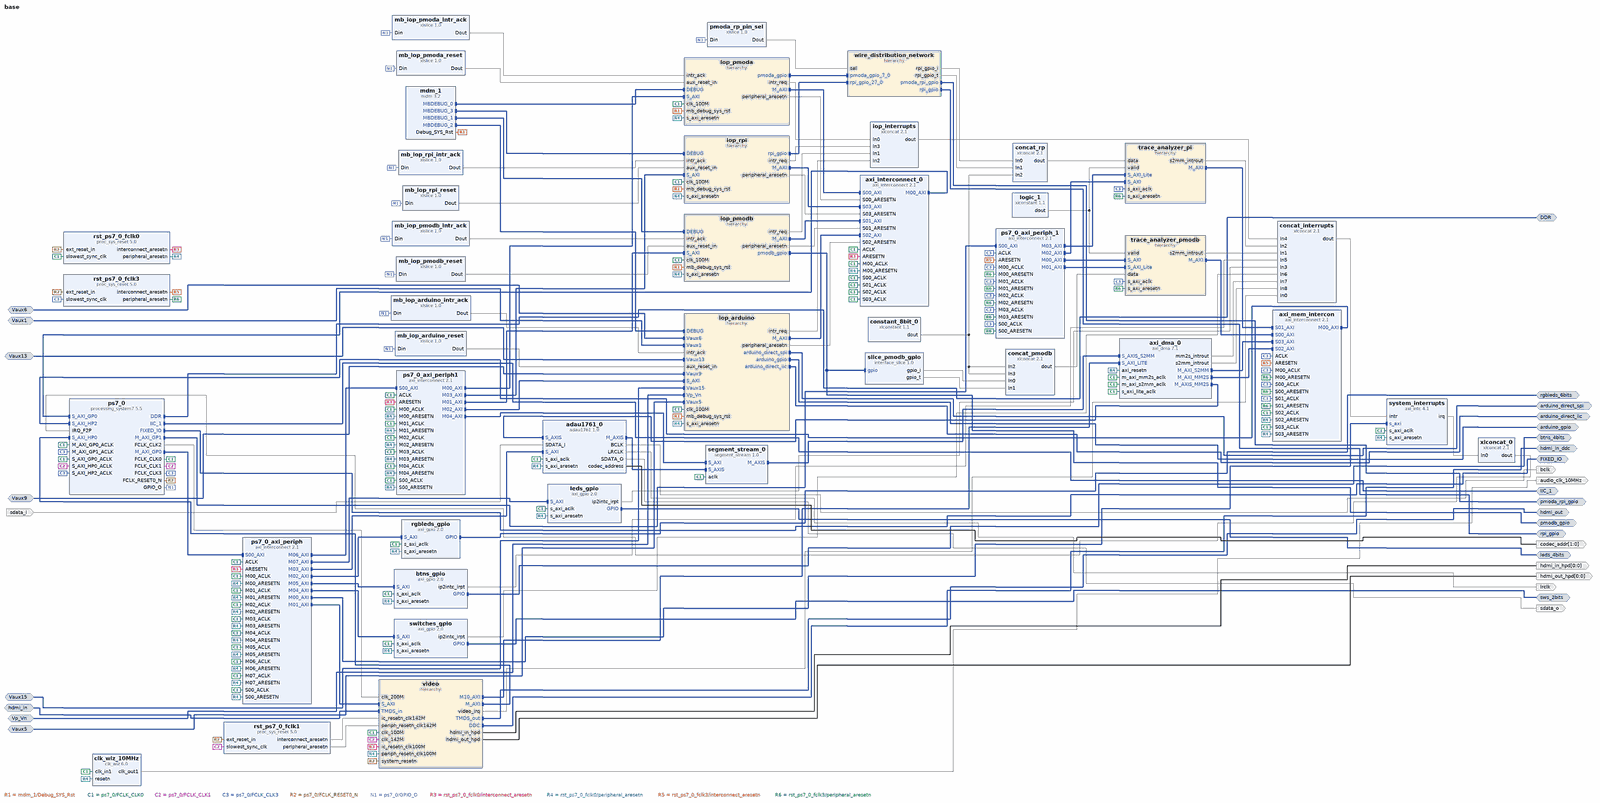
[diagram p0: block diagram of the top level, whole]
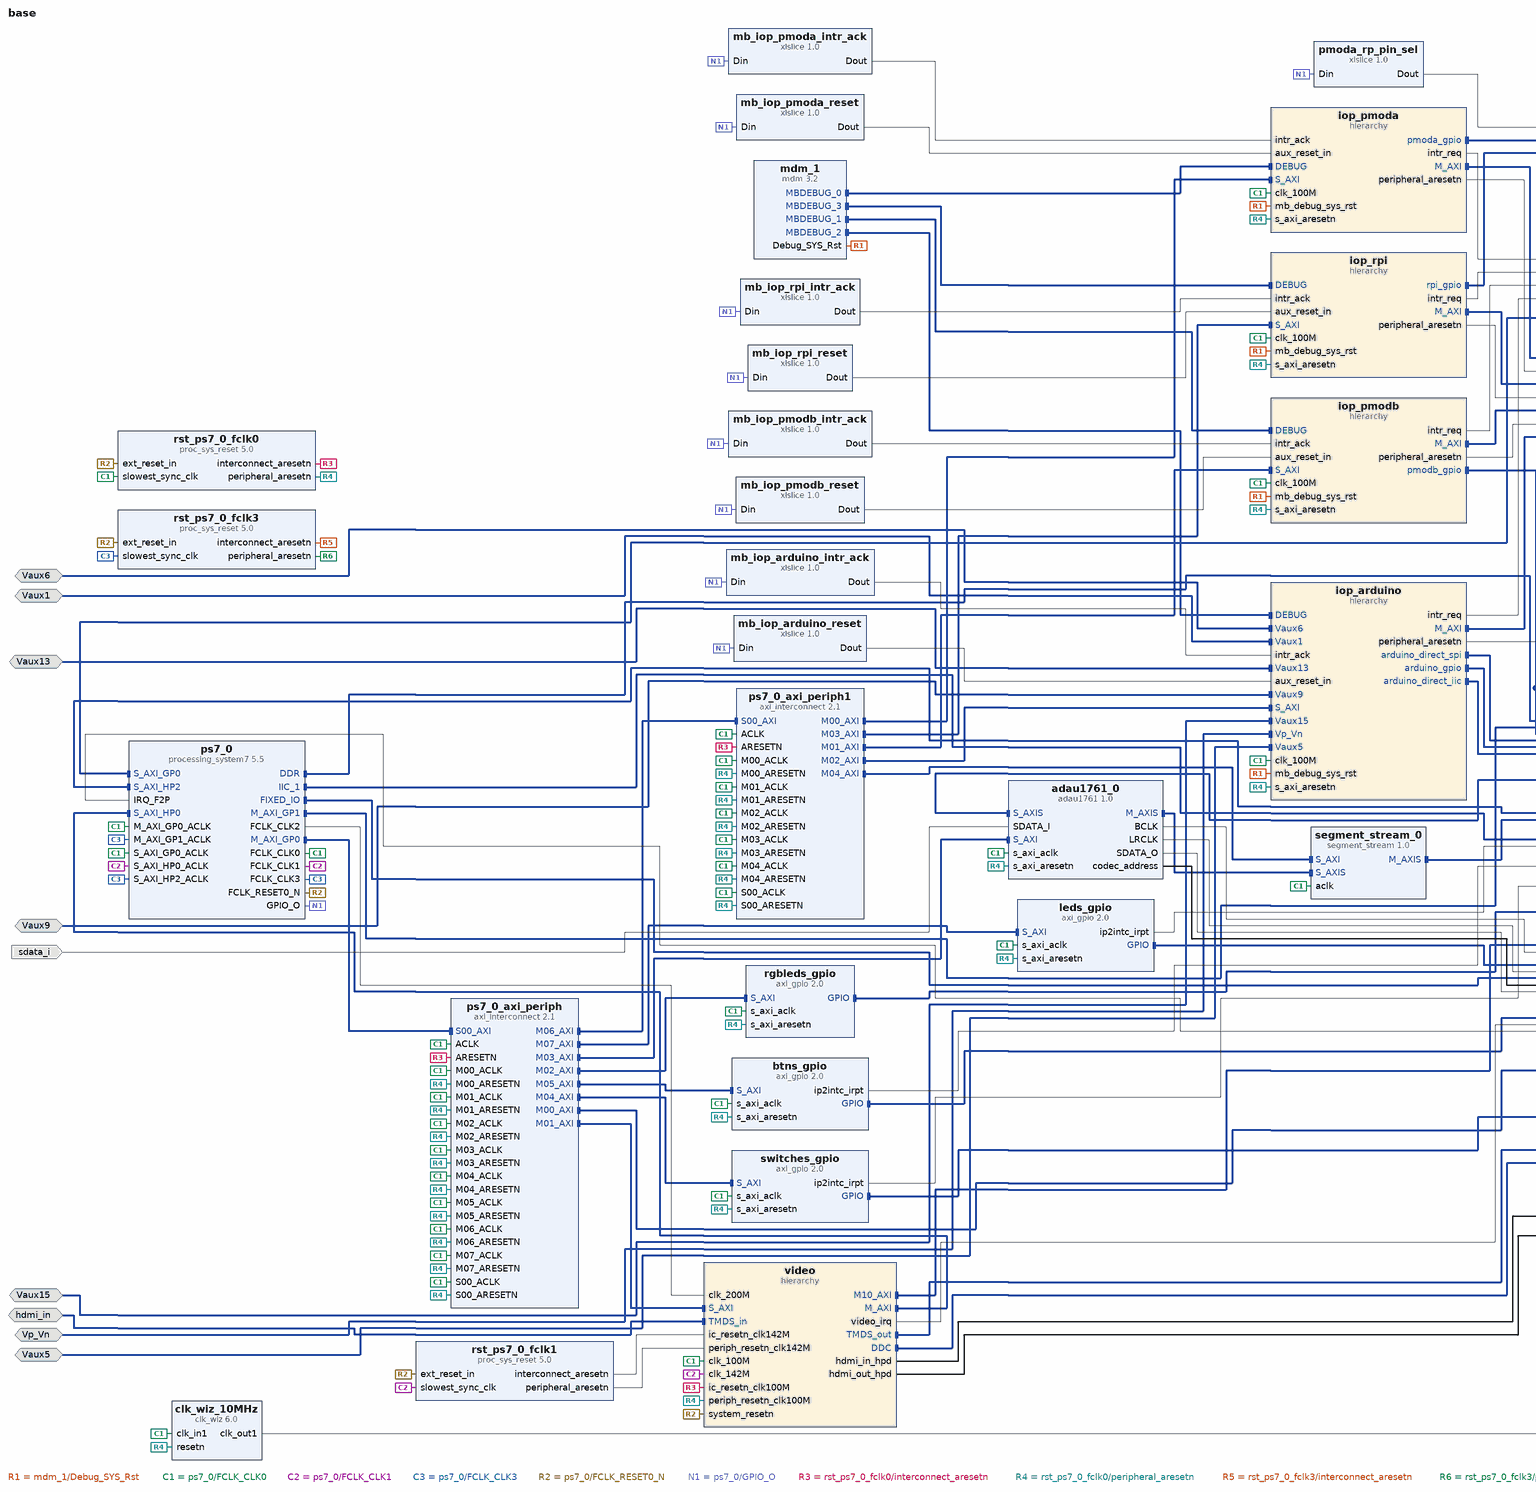
[diagram p1: block diagram of the top level, left part]
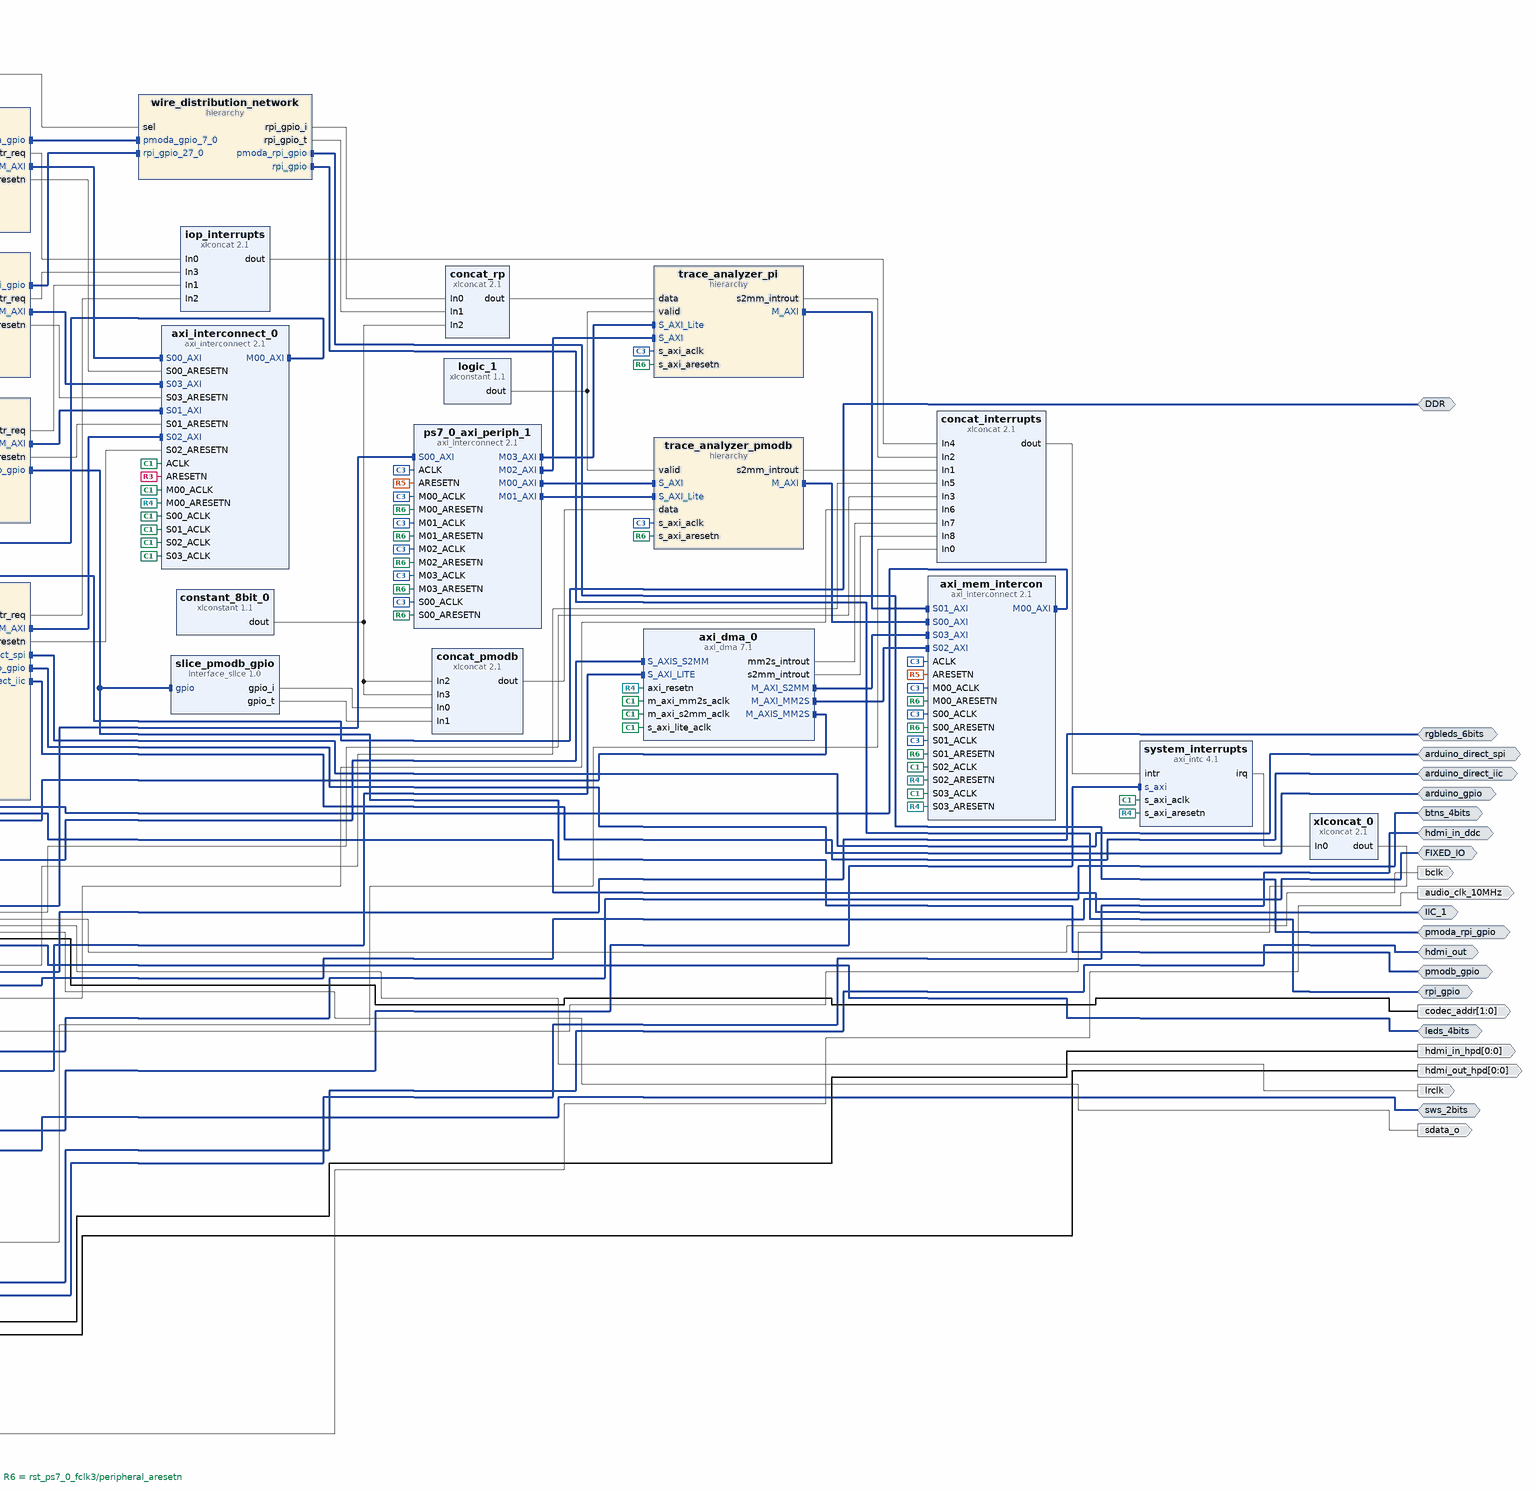
[diagram p2: block diagram of the top level, right part]
# Vivado block design base, xc7z020clg400-1, Vivado 2018.3
create_bd_design base

create_bd_intf_port -mode Master -vlnv xilinx.com:interface:ddrx_rtl:1.0 DDR
create_bd_intf_port -mode Master -vlnv xilinx.com:display_processing_system7:fixedio_rtl:1.0 FIXED_IO
create_bd_intf_port -mode Master -vlnv xilinx.com:interface:iic_rtl:1.0 IIC_1
create_bd_intf_port -mode Slave -vlnv xilinx.com:interface:diff_analog_io_rtl:1.0 Vaux1
create_bd_intf_port -mode Slave -vlnv xilinx.com:interface:diff_analog_io_rtl:1.0 Vaux5
create_bd_intf_port -mode Slave -vlnv xilinx.com:interface:diff_analog_io_rtl:1.0 Vaux6
create_bd_intf_port -mode Slave -vlnv xilinx.com:interface:diff_analog_io_rtl:1.0 Vaux9
create_bd_intf_port -mode Slave -vlnv xilinx.com:interface:diff_analog_io_rtl:1.0 Vaux13
create_bd_intf_port -mode Slave -vlnv xilinx.com:interface:diff_analog_io_rtl:1.0 Vaux15
create_bd_intf_port -mode Slave -vlnv xilinx.com:interface:diff_analog_io_rtl:1.0 Vp_Vn
create_bd_intf_port -mode Master -vlnv xilinx.com:interface:iic_rtl:1.0 arduino_direct_iic
create_bd_intf_port -mode Master -vlnv xilinx.com:interface:spi_rtl:1.0 arduino_direct_spi
create_bd_intf_port -mode Master -vlnv xilinx.com:interface:gpio_rtl:1.0 arduino_gpio
create_bd_intf_port -mode Master -vlnv xilinx.com:interface:gpio_rtl:1.0 btns_4bits
create_bd_intf_port -mode Slave -vlnv digilentinc.com:interface:tmds_rtl:1.0 hdmi_in
create_bd_intf_port -mode Master -vlnv xilinx.com:interface:iic_rtl:1.0 hdmi_in_ddc
create_bd_intf_port -mode Master -vlnv digilentinc.com:interface:tmds_rtl:1.0 hdmi_out
create_bd_intf_port -mode Master -vlnv xilinx.com:interface:gpio_rtl:1.0 leds_4bits
create_bd_intf_port -mode Master -vlnv xilinx.com:interface:gpio_rtl:1.0 pmoda_rpi_gpio
create_bd_intf_port -mode Master -vlnv xilinx.com:interface:gpio_rtl:1.0 pmodb_gpio
create_bd_intf_port -mode Master -vlnv xilinx.com:interface:gpio_rtl:1.0 rgbleds_6bits
create_bd_intf_port -mode Master -vlnv xilinx.com:interface:gpio_rtl:1.0 rpi_gpio
create_bd_intf_port -mode Master -vlnv xilinx.com:interface:gpio_rtl:1.0 sws_2bits
create_bd_port -dir O -type clk audio_clk_10MHz
create_bd_port -dir O bclk
create_bd_port -dir O -from 1 -to 0 codec_addr
create_bd_port -dir O -from 0 -to 0 hdmi_in_hpd
create_bd_port -dir O -from 0 -to 0 hdmi_out_hpd
create_bd_port -dir O lrclk
create_bd_port -dir I sdata_i
create_bd_port -dir O sdata_o

create_bd_cell -type ip -vlnv xilinx.com:ip:axi_interconnect:2.1 axi_interconnect_0
set_property -dict {CONFIG.NUM_MI 1 CONFIG.NUM_SI 4} [get_bd_cells axi_interconnect_0]
create_bd_cell -type ip -vlnv xilinx.com:ip:axi_interconnect:2.1 axi_mem_intercon
set_property -dict {CONFIG.NUM_MI 1 CONFIG.NUM_SI 4} [get_bd_cells axi_mem_intercon]
create_bd_cell -type ip -vlnv xilinx.com:ip:axi_gpio:2.0 btns_gpio
set_property -dict {CONFIG.C_ALL_INPUTS 1 CONFIG.C_GPIO_WIDTH 4 CONFIG.C_INTERRUPT_PRESENT 1} [get_bd_cells btns_gpio]
create_bd_cell -type ip -vlnv xilinx.com:ip:clk_wiz:6.0 clk_wiz_10MHz
set_property -dict [list \
  CONFIG.CLKOUT1_JITTER 290.478 \
  CONFIG.CLKOUT1_PHASE_ERROR 133.882 \
  CONFIG.CLKOUT1_REQUESTED_OUT_FREQ 10.000 \
  CONFIG.MMCM_CLKFBOUT_MULT_F 15.625 \
  CONFIG.MMCM_CLKOUT0_DIVIDE_F 78.125 \
  CONFIG.MMCM_DIVCLK_DIVIDE 2 \
  CONFIG.RESET_PORT resetn \
  CONFIG.RESET_TYPE ACTIVE_LOW \
] [get_bd_cells clk_wiz_10MHz]
create_bd_cell -type ip -vlnv xilinx.com:ip:xlconcat:2.1 concat_interrupts
set_property -dict {CONFIG.NUM_PORTS 9} [get_bd_cells concat_interrupts]
create_bd_cell -type ip -vlnv xilinx.com:ip:xlconcat:2.1 concat_pmodb
set_property -dict {CONFIG.NUM_PORTS 4} [get_bd_cells concat_pmodb]
create_bd_cell -type ip -vlnv xilinx.com:ip:xlconcat:2.1 concat_rp
set_property -dict {CONFIG.NUM_PORTS 3} [get_bd_cells concat_rp]
create_bd_cell -type ip -vlnv xilinx.com:ip:xlconstant:1.1 constant_8bit_0
set_property -dict {CONFIG.CONST_VAL 0 CONFIG.CONST_WIDTH 8} [get_bd_cells constant_8bit_0]
create_bd_cell -type hier iop_arduino
create_bd_cell -type ip -vlnv xilinx.com:ip:xlconcat:2.1 iop_interrupts
set_property -dict {CONFIG.NUM_PORTS 4} [get_bd_cells iop_interrupts]
create_bd_cell -type hier iop_pmoda
create_bd_cell -type hier iop_pmodb
create_bd_cell -type hier iop_rpi
create_bd_cell -type ip -vlnv xilinx.com:ip:axi_gpio:2.0 leds_gpio
set_property -dict [list \
  CONFIG.C_ALL_OUTPUTS 1 \
  CONFIG.C_GPIO_WIDTH 4 \
  CONFIG.C_INTERRUPT_PRESENT 1 \
  CONFIG.C_IS_DUAL 0 \
] [get_bd_cells leds_gpio]
create_bd_cell -type ip -vlnv xilinx.com:ip:xlconstant:1.1 logic_1
create_bd_cell -type ip -vlnv xilinx.com:ip:xlslice:1.0 mb_iop_arduino_intr_ack
set_property -dict [list \
  CONFIG.DIN_FROM 6 \
  CONFIG.DIN_TO 6 \
  CONFIG.DIN_WIDTH 10 \
  CONFIG.DOUT_WIDTH 1 \
] [get_bd_cells mb_iop_arduino_intr_ack]
create_bd_cell -type ip -vlnv xilinx.com:ip:xlslice:1.0 mb_iop_arduino_reset
set_property -dict {CONFIG.DIN_FROM 2 CONFIG.DIN_TO 2 CONFIG.DIN_WIDTH 10 CONFIG.DOUT_WIDTH 1} [get_bd_cells mb_iop_arduino_reset]
create_bd_cell -type ip -vlnv xilinx.com:ip:xlslice:1.0 mb_iop_pmoda_intr_ack
set_property -dict [list \
  CONFIG.DIN_FROM 4 \
  CONFIG.DIN_TO 4 \
  CONFIG.DIN_WIDTH 10 \
  CONFIG.DOUT_WIDTH 1 \
] [get_bd_cells mb_iop_pmoda_intr_ack]
create_bd_cell -type ip -vlnv xilinx.com:ip:xlslice:1.0 mb_iop_pmoda_reset
set_property -dict {CONFIG.DIN_FROM 0 CONFIG.DIN_TO 0 CONFIG.DIN_WIDTH 10 CONFIG.DOUT_WIDTH 1} [get_bd_cells mb_iop_pmoda_reset]
create_bd_cell -type ip -vlnv xilinx.com:ip:xlslice:1.0 mb_iop_pmodb_intr_ack
set_property -dict [list \
  CONFIG.DIN_FROM 5 \
  CONFIG.DIN_TO 5 \
  CONFIG.DIN_WIDTH 10 \
  CONFIG.DOUT_WIDTH 1 \
] [get_bd_cells mb_iop_pmodb_intr_ack]
create_bd_cell -type ip -vlnv xilinx.com:ip:xlslice:1.0 mb_iop_pmodb_reset
set_property -dict {CONFIG.DIN_FROM 1 CONFIG.DIN_TO 1 CONFIG.DIN_WIDTH 10 CONFIG.DOUT_WIDTH 1} [get_bd_cells mb_iop_pmodb_reset]
create_bd_cell -type ip -vlnv xilinx.com:ip:xlslice:1.0 mb_iop_rpi_intr_ack
set_property -dict {CONFIG.DIN_FROM 7 CONFIG.DIN_TO 7 CONFIG.DIN_WIDTH 10 CONFIG.DOUT_WIDTH 1} [get_bd_cells mb_iop_rpi_intr_ack]
create_bd_cell -type ip -vlnv xilinx.com:ip:xlslice:1.0 mb_iop_rpi_reset
set_property -dict {CONFIG.DIN_FROM 3 CONFIG.DIN_TO 3 CONFIG.DIN_WIDTH 10 CONFIG.DOUT_WIDTH 1} [get_bd_cells mb_iop_rpi_reset]
create_bd_cell -type ip -vlnv xilinx.com:ip:mdm:3.2 mdm_1
set_property -dict {CONFIG.C_MB_DBG_PORTS 4} [get_bd_cells mdm_1]
create_bd_cell -type ip -vlnv xilinx.com:ip:xlslice:1.0 pmoda_rp_pin_sel
set_property -dict {CONFIG.DIN_FROM 8 CONFIG.DIN_TO 8 CONFIG.DIN_WIDTH 10 CONFIG.DOUT_WIDTH 1} [get_bd_cells pmoda_rp_pin_sel]
create_bd_cell -type ip -vlnv xilinx.com:ip:processing_system7:5.5 ps7_0
set_property -dict [list \
  CONFIG.PCW_APU_PERIPHERAL_FREQMHZ 650 \
  CONFIG.PCW_CRYSTAL_PERIPHERAL_FREQMHZ 50 \
  CONFIG.PCW_ENET0_ENET0_IO {MIO 16 .. 27} \
  CONFIG.PCW_ENET0_GRP_MDIO_ENABLE 1 \
  CONFIG.PCW_ENET0_GRP_MDIO_IO {MIO 52 .. 53} \
  CONFIG.PCW_ENET0_PERIPHERAL_ENABLE 1 \
  CONFIG.PCW_EN_CLK1_PORT 1 \
  CONFIG.PCW_EN_CLK2_PORT 1 \
  CONFIG.PCW_EN_CLK3_PORT 1 \
  CONFIG.PCW_FCLK_CLK1_BUF TRUE \
  CONFIG.PCW_FCLK_CLK2_BUF TRUE \
  CONFIG.PCW_FCLK_CLK3_BUF TRUE \
  CONFIG.PCW_FPGA0_PERIPHERAL_FREQMHZ 100 \
  CONFIG.PCW_FPGA1_PERIPHERAL_FREQMHZ 142 \
  CONFIG.PCW_FPGA2_PERIPHERAL_FREQMHZ 200 \
  CONFIG.PCW_FPGA3_PERIPHERAL_FREQMHZ 100 \
  CONFIG.PCW_FPGA_FCLK1_ENABLE 1 \
  CONFIG.PCW_FPGA_FCLK2_ENABLE 1 \
  CONFIG.PCW_FPGA_FCLK3_ENABLE 1 \
  CONFIG.PCW_GPIO_EMIO_GPIO_ENABLE 1 \
  CONFIG.PCW_GPIO_EMIO_GPIO_IO 10 \
  CONFIG.PCW_GPIO_EMIO_GPIO_WIDTH 10 \
  CONFIG.PCW_GPIO_MIO_GPIO_ENABLE 0 \
  CONFIG.PCW_I2C0_GRP_INT_ENABLE 1 \
  CONFIG.PCW_I2C0_GRP_INT_IO EMIO \
  CONFIG.PCW_I2C0_I2C0_IO {MIO 50 .. 51} \
  CONFIG.PCW_I2C0_PERIPHERAL_ENABLE 1 \
  CONFIG.PCW_I2C1_I2C1_IO EMIO \
  CONFIG.PCW_I2C1_PERIPHERAL_ENABLE 1 \
  CONFIG.PCW_I2C_PERIPHERAL_FREQMHZ 108.333336 \
  CONFIG.PCW_IRQ_F2P_INTR 1 \
  CONFIG.PCW_PERIPHERAL_BOARD_PRESET None \
  CONFIG.PCW_PRESET_BANK1_VOLTAGE {LVCMOS 1.8V} \
  CONFIG.PCW_QSPI_GRP_FBCLK_ENABLE 1 \
  CONFIG.PCW_QSPI_GRP_FBCLK_IO {MIO 8} \
  CONFIG.PCW_QSPI_GRP_SINGLE_SS_ENABLE 1 \
  CONFIG.PCW_QSPI_GRP_SINGLE_SS_IO {MIO 1 .. 6} \
  CONFIG.PCW_QSPI_PERIPHERAL_ENABLE 1 \
  CONFIG.PCW_QSPI_QSPI_IO {MIO 1 .. 6} \
  CONFIG.PCW_SD0_GRP_CD_ENABLE 1 \
  CONFIG.PCW_SD0_GRP_CD_IO {MIO 47} \
  CONFIG.PCW_SD0_GRP_WP_ENABLE 0 \
  CONFIG.PCW_SD0_PERIPHERAL_ENABLE 1 \
  CONFIG.PCW_SD0_SD0_IO {MIO 40 .. 45} \
  CONFIG.PCW_SDIO_PERIPHERAL_FREQMHZ 50 \
  CONFIG.PCW_SINGLE_QSPI_DATA_MODE x4 \
  CONFIG.PCW_UART0_PERIPHERAL_ENABLE 1 \
  CONFIG.PCW_UART0_UART0_IO {MIO 14 .. 15} \
  CONFIG.PCW_UART1_PERIPHERAL_ENABLE 0 \
  CONFIG.PCW_UART_PERIPHERAL_FREQMHZ 100 \
  CONFIG.PCW_UIPARAM_DDR_BUS_WIDTH {16 Bit} \
  CONFIG.PCW_UIPARAM_DDR_FREQ_MHZ 525 \
  CONFIG.PCW_UIPARAM_DDR_PARTNO Custom \
  CONFIG.PCW_USB0_PERIPHERAL_ENABLE 1 \
  CONFIG.PCW_USB0_USB0_IO {MIO 28 .. 39} \
  CONFIG.PCW_USE_FABRIC_INTERRUPT 1 \
  CONFIG.PCW_USE_M_AXI_GP1 1 \
  CONFIG.PCW_USE_S_AXI_GP0 1 \
  CONFIG.PCW_USE_S_AXI_HP0 1 \
  CONFIG.PCW_USE_S_AXI_HP2 1 \
] [get_bd_cells ps7_0]
# 485 more settings of ps7_0 are not shown: defaults, MIO pin electricals, DDR timing, and values the tool derives
create_bd_cell -type ip -vlnv xilinx.com:ip:axi_interconnect:2.1 ps7_0_axi_periph
set_property -dict [list \
  CONFIG.M00_HAS_REGSLICE 1 \
  CONFIG.M01_HAS_REGSLICE 1 \
  CONFIG.M02_HAS_REGSLICE 1 \
  CONFIG.M03_HAS_REGSLICE 1 \
  CONFIG.M04_HAS_REGSLICE 1 \
  CONFIG.M05_HAS_REGSLICE 1 \
  CONFIG.M06_HAS_REGSLICE 1 \
  CONFIG.M07_HAS_REGSLICE 1 \
  CONFIG.M08_HAS_REGSLICE 1 \
  CONFIG.M09_HAS_REGSLICE 1 \
  CONFIG.NUM_MI 8 \
  CONFIG.S00_HAS_REGSLICE 1 \
] [get_bd_cells ps7_0_axi_periph]
create_bd_cell -type ip -vlnv xilinx.com:ip:axi_interconnect:2.1 ps7_0_axi_periph1
set_property -dict [list \
  CONFIG.M00_HAS_REGSLICE 1 \
  CONFIG.M01_HAS_REGSLICE 1 \
  CONFIG.M02_HAS_REGSLICE 1 \
  CONFIG.M03_HAS_REGSLICE 1 \
  CONFIG.M04_HAS_REGSLICE 1 \
  CONFIG.M05_HAS_REGSLICE 1 \
  CONFIG.M06_HAS_REGSLICE 1 \
  CONFIG.M07_HAS_REGSLICE 1 \
  CONFIG.M08_HAS_REGSLICE 1 \
  CONFIG.M09_HAS_REGSLICE 1 \
  CONFIG.NUM_MI 5 \
  CONFIG.S00_HAS_REGSLICE 1 \
] [get_bd_cells ps7_0_axi_periph1]
create_bd_cell -type ip -vlnv xilinx.com:ip:axi_interconnect:2.1 ps7_0_axi_periph_1
set_property -dict {CONFIG.NUM_MI 4} [get_bd_cells ps7_0_axi_periph_1]
create_bd_cell -type ip -vlnv xilinx.com:ip:axi_gpio:2.0 rgbleds_gpio
set_property -dict {CONFIG.C_ALL_OUTPUTS 1 CONFIG.C_GPIO_WIDTH 6} [get_bd_cells rgbleds_gpio]
create_bd_cell -type ip -vlnv xilinx.com:ip:proc_sys_reset:5.0 rst_ps7_0_fclk0
create_bd_cell -type ip -vlnv xilinx.com:ip:proc_sys_reset:5.0 rst_ps7_0_fclk1
create_bd_cell -type ip -vlnv xilinx.com:ip:proc_sys_reset:5.0 rst_ps7_0_fclk3
create_bd_cell -type ip -vlnv xilinx.com:user:interface_slice:1.0 slice_pmodb_gpio
set_property -dict {CONFIG.WIDTH 8} [get_bd_cells slice_pmodb_gpio]
create_bd_cell -type ip -vlnv xilinx.com:ip:axi_gpio:2.0 switches_gpio
set_property -dict [list \
  CONFIG.C_ALL_INPUTS 1 \
  CONFIG.C_GPIO_WIDTH 2 \
  CONFIG.C_INTERRUPT_PRESENT 1 \
  CONFIG.C_IS_DUAL 0 \
] [get_bd_cells switches_gpio]
create_bd_cell -type ip -vlnv xilinx.com:ip:axi_intc:4.1 system_interrupts
create_bd_cell -type hier trace_analyzer_pi
create_bd_cell -type hier trace_analyzer_pmodb
create_bd_cell -type hier video
create_bd_cell -type hier wire_distribution_network
create_bd_cell -type ip -vlnv xilinx.com:ip:xlconcat:2.1 xlconcat_0
set_property -dict {CONFIG.NUM_PORTS 1} [get_bd_cells xlconcat_0]
create_bd_cell -type ip -vlnv xilinx.com:user:adau1761:1.0 adau1761_0
create_bd_cell -type ip -vlnv xilinx.com:ip:axi_dma:7.1 axi_dma_0
set_property -dict [list \
  CONFIG.c_include_mm2s_dre 0 \
  CONFIG.c_include_s2mm 1 \
  CONFIG.c_include_s2mm_dre 0 \
  CONFIG.c_include_sg 0 \
  CONFIG.c_m_axi_mm2s_data_width 64 \
  CONFIG.c_m_axis_mm2s_tdata_width 64 \
  CONFIG.c_micro_dma 0 \
  CONFIG.c_mm2s_burst_size 4 \
  CONFIG.c_s2mm_burst_size 8 \
] [get_bd_cells axi_dma_0]
create_bd_cell -type ip -vlnv xilinx.com:user:segment_stream:1.0 segment_stream_0

# ---- hierarchy /iop_arduino ----
current_bd_instance /iop_arduino
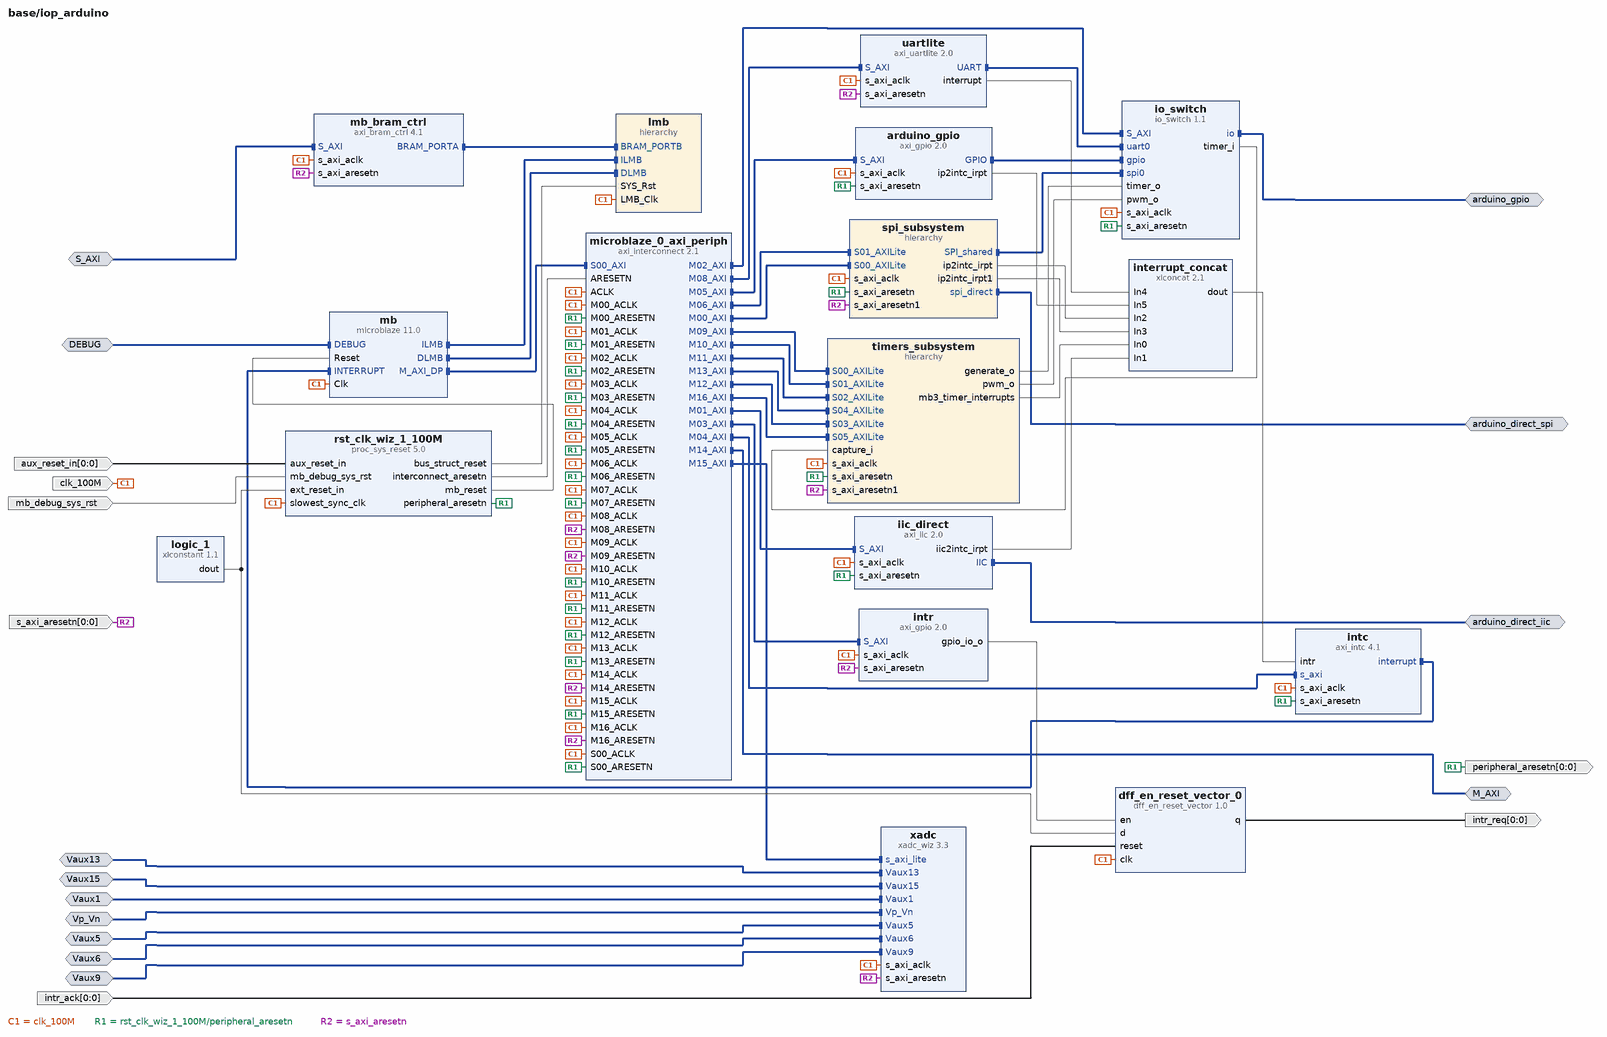
[diagram p3: block diagram inside /iop_arduino]
create_bd_intf_pin -mode Slave -vlnv xilinx.com:interface:mbdebug_rtl:3.0 DEBUG
create_bd_intf_pin -mode Master -vlnv xilinx.com:interface:aximm_rtl:1.0 M_AXI
create_bd_intf_pin -mode Slave -vlnv xilinx.com:interface:aximm_rtl:1.0 S_AXI
create_bd_intf_pin -mode Slave -vlnv xilinx.com:interface:diff_analog_io_rtl:1.0 Vaux1
create_bd_intf_pin -mode Slave -vlnv xilinx.com:interface:diff_analog_io_rtl:1.0 Vaux5
create_bd_intf_pin -mode Slave -vlnv xilinx.com:interface:diff_analog_io_rtl:1.0 Vaux6
create_bd_intf_pin -mode Slave -vlnv xilinx.com:interface:diff_analog_io_rtl:1.0 Vaux9
create_bd_intf_pin -mode Slave -vlnv xilinx.com:interface:diff_analog_io_rtl:1.0 Vaux13
create_bd_intf_pin -mode Slave -vlnv xilinx.com:interface:diff_analog_io_rtl:1.0 Vaux15
create_bd_intf_pin -mode Slave -vlnv xilinx.com:interface:diff_analog_io_rtl:1.0 Vp_Vn
create_bd_intf_pin -mode Master -vlnv xilinx.com:interface:iic_rtl:1.0 arduino_direct_iic
create_bd_intf_pin -mode Master -vlnv xilinx.com:interface:spi_rtl:1.0 arduino_direct_spi
create_bd_intf_pin -mode Master -vlnv xilinx.com:interface:gpio_rtl:1.0 arduino_gpio
create_bd_pin -dir I -from 0 -to 0 -type rst aux_reset_in
create_bd_pin -dir I -type clk clk_100M
create_bd_pin -dir I -from 0 -to 0 intr_ack
create_bd_pin -dir O -from 0 -to 0 intr_req
create_bd_pin -dir I -type rst mb_debug_sys_rst
create_bd_pin -dir O -from 0 -to 0 -type rst peripheral_aresetn
create_bd_pin -dir I -from 0 -to 0 -type rst s_axi_aresetn

create_bd_cell -type ip -vlnv xilinx.com:ip:axi_gpio:2.0 arduino_gpio
set_property -dict {CONFIG.C_GPIO_WIDTH 20 CONFIG.C_INTERRUPT_PRESENT 1 CONFIG.C_IS_DUAL 0} [get_bd_cells arduino_gpio]
create_bd_cell -type ip -vlnv xilinx.com:user:dff_en_reset_vector:1.0 dff_en_reset_vector_0
set_property -dict {CONFIG.SIZE 1} [get_bd_cells dff_en_reset_vector_0]
create_bd_cell -type ip -vlnv xilinx.com:ip:axi_iic:2.0 iic_direct
create_bd_cell -type ip -vlnv xilinx.com:ip:axi_intc:4.1 intc
create_bd_cell -type ip -vlnv xilinx.com:ip:xlconcat:2.1 interrupt_concat
set_property -dict {CONFIG.NUM_PORTS 6} [get_bd_cells interrupt_concat]
create_bd_cell -type ip -vlnv xilinx.com:ip:axi_gpio:2.0 intr
set_property -dict {CONFIG.C_ALL_OUTPUTS 1 CONFIG.C_GPIO_WIDTH 1} [get_bd_cells intr]
create_bd_cell -type ip -vlnv xilinx.com:user:io_switch:1.1 io_switch
set_property -dict [list \
  CONFIG.C_INTERFACE_TYPE 3 \
  CONFIG.C_IO_SWITCH_WIDTH 20 \
  CONFIG.I2C0_Enable false \
  CONFIG.PWM_Enable true \
  CONFIG.SPI0_Enable true \
  CONFIG.SPI1_Enable false \
  CONFIG.Timer_Enable true \
  CONFIG.UART0_Enable true \
] [get_bd_cells io_switch]
create_bd_cell -type hier lmb
create_bd_cell -type ip -vlnv xilinx.com:ip:xlconstant:1.1 logic_1
create_bd_cell -type ip -vlnv xilinx.com:ip:microblaze:11.0 mb
set_property -dict {CONFIG.C_DEBUG_ENABLED 1 CONFIG.C_D_AXI 1 CONFIG.C_D_LMB 1 CONFIG.C_I_LMB 1} [get_bd_cells mb]
create_bd_cell -type ip -vlnv xilinx.com:ip:axi_bram_ctrl:4.1 mb_bram_ctrl
set_property -dict {CONFIG.SINGLE_PORT_BRAM 1} [get_bd_cells mb_bram_ctrl]
create_bd_cell -type ip -vlnv xilinx.com:ip:axi_interconnect:2.1 microblaze_0_axi_periph
set_property -dict [list \
  CONFIG.M00_HAS_REGSLICE 1 \
  CONFIG.M01_HAS_REGSLICE 1 \
  CONFIG.M02_HAS_REGSLICE 1 \
  CONFIG.M03_HAS_REGSLICE 1 \
  CONFIG.M04_HAS_REGSLICE 1 \
  CONFIG.M05_HAS_REGSLICE 1 \
  CONFIG.M06_HAS_REGSLICE 1 \
  CONFIG.M07_HAS_REGSLICE 1 \
  CONFIG.M08_HAS_REGSLICE 1 \
  CONFIG.M09_HAS_REGSLICE 1 \
  CONFIG.M10_HAS_REGSLICE 1 \
  CONFIG.M11_HAS_REGSLICE 1 \
  CONFIG.M12_HAS_REGSLICE 1 \
  CONFIG.M13_HAS_REGSLICE 1 \
  CONFIG.M14_HAS_REGSLICE 1 \
  CONFIG.M15_HAS_REGSLICE 1 \
  CONFIG.M16_HAS_REGSLICE 1 \
  CONFIG.NUM_MI 17 \
  CONFIG.S00_HAS_REGSLICE 1 \
] [get_bd_cells microblaze_0_axi_periph]
create_bd_cell -type ip -vlnv xilinx.com:ip:proc_sys_reset:5.0 rst_clk_wiz_1_100M
set_property -dict {CONFIG.C_AUX_RESET_HIGH 1} [get_bd_cells rst_clk_wiz_1_100M]
create_bd_cell -type hier spi_subsystem
create_bd_cell -type hier timers_subsystem
create_bd_cell -type ip -vlnv xilinx.com:ip:axi_uartlite:2.0 uartlite
set_property -dict {CONFIG.C_BAUDRATE 9600} [get_bd_cells uartlite]
create_bd_cell -type ip -vlnv xilinx.com:ip:xadc_wiz:3.3 xadc
set_property -dict [list \
  CONFIG.AVERAGE_ENABLE_TEMPERATURE true \
  CONFIG.AVERAGE_ENABLE_VAUXP0_VAUXN0 false \
  CONFIG.AVERAGE_ENABLE_VAUXP12_VAUXN12 false \
  CONFIG.AVERAGE_ENABLE_VAUXP13_VAUXN13 true \
  CONFIG.AVERAGE_ENABLE_VAUXP15_VAUXN15 true \
  CONFIG.AVERAGE_ENABLE_VAUXP1_VAUXN1 true \
  CONFIG.AVERAGE_ENABLE_VAUXP5_VAUXN5 true \
  CONFIG.AVERAGE_ENABLE_VAUXP6_VAUXN6 true \
  CONFIG.AVERAGE_ENABLE_VAUXP8_VAUXN8 false \
  CONFIG.AVERAGE_ENABLE_VAUXP9_VAUXN9 true \
  CONFIG.AVERAGE_ENABLE_VP_VN true \
  CONFIG.BIPOLAR_VAUXP0_VAUXN0 false \
  CONFIG.BIPOLAR_VAUXP12_VAUXN12 false \
  CONFIG.BIPOLAR_VAUXP8_VAUXN8 false \
  CONFIG.CHANNEL_AVERAGING 16 \
  CONFIG.CHANNEL_ENABLE_TEMPERATURE true \
  CONFIG.CHANNEL_ENABLE_VAUXP0_VAUXN0 false \
  CONFIG.CHANNEL_ENABLE_VAUXP12_VAUXN12 false \
  CONFIG.CHANNEL_ENABLE_VAUXP13_VAUXN13 true \
  CONFIG.CHANNEL_ENABLE_VAUXP15_VAUXN15 true \
  CONFIG.CHANNEL_ENABLE_VAUXP1_VAUXN1 true \
  CONFIG.CHANNEL_ENABLE_VAUXP5_VAUXN5 true \
  CONFIG.CHANNEL_ENABLE_VAUXP6_VAUXN6 true \
  CONFIG.CHANNEL_ENABLE_VAUXP8_VAUXN8 false \
  CONFIG.CHANNEL_ENABLE_VAUXP9_VAUXN9 true \
  CONFIG.CHANNEL_ENABLE_VP_VN true \
  CONFIG.CHANNEL_ENABLE_VREFN false \
  CONFIG.CHANNEL_ENABLE_VREFP false \
  CONFIG.ENABLE_RESET false \
  CONFIG.ENABLE_VCCDDRO_ALARM false \
  CONFIG.ENABLE_VCCPAUX_ALARM false \
  CONFIG.ENABLE_VCCPINT_ALARM false \
  CONFIG.EXTERNAL_MUX_CHANNEL VP_VN \
  CONFIG.INTERFACE_SELECTION Enable_AXI \
  CONFIG.OT_ALARM false \
  CONFIG.SEQUENCER_MODE Continuous \
  CONFIG.SINGLE_CHANNEL_SELECTION TEMPERATURE \
  CONFIG.USER_TEMP_ALARM false \
  CONFIG.VCCAUX_ALARM false \
  CONFIG.VCCINT_ALARM false \
  CONFIG.XADC_STARUP_SELECTION channel_sequencer \
] [get_bd_cells xadc]

# ---- hierarchy /iop_arduino/lmb ----
current_bd_instance /iop_arduino/lmb
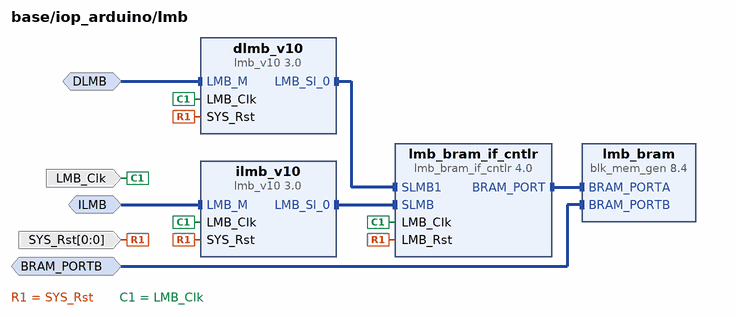
[diagram p4: block diagram inside /iop_arduino/lmb]
create_bd_intf_pin -mode Slave -vlnv xilinx.com:interface:bram_rtl:1.0 BRAM_PORTB
create_bd_intf_pin -mode MirroredMaster -vlnv xilinx.com:interface:lmb_rtl:1.0 DLMB
create_bd_intf_pin -mode MirroredMaster -vlnv xilinx.com:interface:lmb_rtl:1.0 ILMB
create_bd_pin -dir I -type clk LMB_Clk
create_bd_pin -dir I -from 0 -to 0 -type rst SYS_Rst

create_bd_cell -type ip -vlnv xilinx.com:ip:lmb_v10:3.0 dlmb_v10
create_bd_cell -type ip -vlnv xilinx.com:ip:lmb_v10:3.0 ilmb_v10
create_bd_cell -type ip -vlnv xilinx.com:ip:blk_mem_gen:8.4 lmb_bram
set_property -dict [list \
  CONFIG.Enable_B Use_ENB_Pin \
  CONFIG.Memory_Type True_Dual_Port_RAM \
  CONFIG.Port_B_Clock 100 \
  CONFIG.Port_B_Enable_Rate 100 \
  CONFIG.Port_B_Write_Rate 50 \
  CONFIG.Use_RSTB_Pin true \
  CONFIG.use_bram_block BRAM_Controller \
] [get_bd_cells lmb_bram]
create_bd_cell -type ip -vlnv xilinx.com:ip:lmb_bram_if_cntlr:4.0 lmb_bram_if_cntlr
set_property -dict {CONFIG.C_ECC 0 CONFIG.C_NUM_LMB 2} [get_bd_cells lmb_bram_if_cntlr]

# ---- hierarchy /iop_arduino/spi_subsystem ----
current_bd_instance /iop_arduino/spi_subsystem
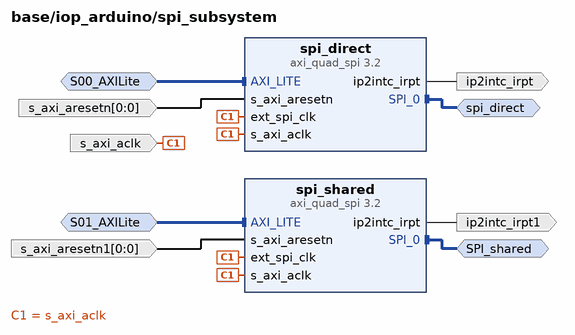
[diagram p5: block diagram inside /iop_arduino/spi_subsystem]
create_bd_intf_pin -mode Slave -vlnv xilinx.com:interface:aximm_rtl:1.0 S00_AXILite
create_bd_intf_pin -mode Slave -vlnv xilinx.com:interface:aximm_rtl:1.0 S01_AXILite
create_bd_intf_pin -mode Master -vlnv xilinx.com:interface:spi_rtl:1.0 SPI_shared
create_bd_intf_pin -mode Master -vlnv xilinx.com:interface:spi_rtl:1.0 spi_direct
create_bd_pin -dir O -type intr ip2intc_irpt
create_bd_pin -dir O -type intr ip2intc_irpt1
create_bd_pin -dir I -type clk s_axi_aclk
create_bd_pin -dir I -from 0 -to 0 -type rst s_axi_aresetn
create_bd_pin -dir I -from 0 -to 0 -type rst s_axi_aresetn1

create_bd_cell -type ip -vlnv xilinx.com:ip:axi_quad_spi:3.2 spi_direct
set_property -dict {CONFIG.C_USE_STARTUP 0} [get_bd_cells spi_direct]
create_bd_cell -type ip -vlnv xilinx.com:ip:axi_quad_spi:3.2 spi_shared
set_property -dict {CONFIG.C_USE_STARTUP 0} [get_bd_cells spi_shared]

# ---- hierarchy /iop_arduino/timers_subsystem ----
current_bd_instance /iop_arduino/timers_subsystem
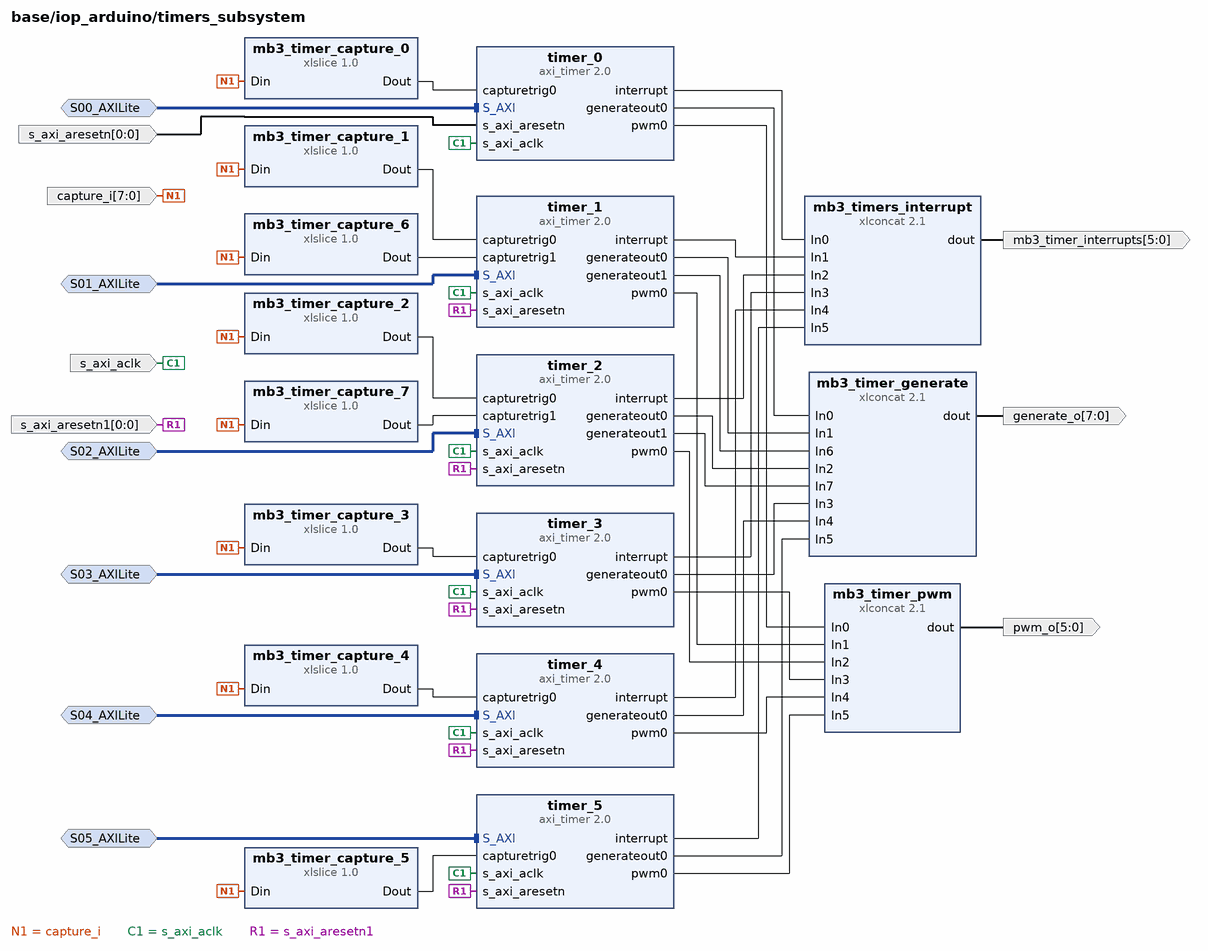
[diagram p6: block diagram inside /iop_arduino/timers_subsystem]
create_bd_intf_pin -mode Slave -vlnv xilinx.com:interface:aximm_rtl:1.0 S00_AXILite
create_bd_intf_pin -mode Slave -vlnv xilinx.com:interface:aximm_rtl:1.0 S01_AXILite
create_bd_intf_pin -mode Slave -vlnv xilinx.com:interface:aximm_rtl:1.0 S02_AXILite
create_bd_intf_pin -mode Slave -vlnv xilinx.com:interface:aximm_rtl:1.0 S03_AXILite
create_bd_intf_pin -mode Slave -vlnv xilinx.com:interface:aximm_rtl:1.0 S04_AXILite
create_bd_intf_pin -mode Slave -vlnv xilinx.com:interface:aximm_rtl:1.0 S05_AXILite
create_bd_pin -dir I -from 7 -to 0 capture_i
create_bd_pin -dir O -from 7 -to 0 generate_o
create_bd_pin -dir O -from 5 -to 0 mb3_timer_interrupts
create_bd_pin -dir O -from 5 -to 0 pwm_o
create_bd_pin -dir I -type clk s_axi_aclk
create_bd_pin -dir I -from 0 -to 0 -type rst s_axi_aresetn
create_bd_pin -dir I -from 0 -to 0 -type rst s_axi_aresetn1

create_bd_cell -type ip -vlnv xilinx.com:ip:xlslice:1.0 mb3_timer_capture_0
set_property -dict {CONFIG.DIN_FROM 0 CONFIG.DIN_TO 0 CONFIG.DIN_WIDTH 8} [get_bd_cells mb3_timer_capture_0]
create_bd_cell -type ip -vlnv xilinx.com:ip:xlslice:1.0 mb3_timer_capture_1
set_property -dict {CONFIG.DIN_FROM 1 CONFIG.DIN_TO 1 CONFIG.DIN_WIDTH 8 CONFIG.DOUT_WIDTH 1} [get_bd_cells mb3_timer_capture_1]
create_bd_cell -type ip -vlnv xilinx.com:ip:xlslice:1.0 mb3_timer_capture_2
set_property -dict {CONFIG.DIN_FROM 2 CONFIG.DIN_TO 2 CONFIG.DIN_WIDTH 8 CONFIG.DOUT_WIDTH 1} [get_bd_cells mb3_timer_capture_2]
create_bd_cell -type ip -vlnv xilinx.com:ip:xlslice:1.0 mb3_timer_capture_3
set_property -dict {CONFIG.DIN_FROM 3 CONFIG.DIN_TO 3 CONFIG.DIN_WIDTH 8 CONFIG.DOUT_WIDTH 1} [get_bd_cells mb3_timer_capture_3]
create_bd_cell -type ip -vlnv xilinx.com:ip:xlslice:1.0 mb3_timer_capture_4
set_property -dict {CONFIG.DIN_FROM 4 CONFIG.DIN_TO 4 CONFIG.DIN_WIDTH 8 CONFIG.DOUT_WIDTH 1} [get_bd_cells mb3_timer_capture_4]
create_bd_cell -type ip -vlnv xilinx.com:ip:xlslice:1.0 mb3_timer_capture_5
set_property -dict {CONFIG.DIN_FROM 5 CONFIG.DIN_TO 5 CONFIG.DIN_WIDTH 8 CONFIG.DOUT_WIDTH 1} [get_bd_cells mb3_timer_capture_5]
create_bd_cell -type ip -vlnv xilinx.com:ip:xlslice:1.0 mb3_timer_capture_6
set_property -dict {CONFIG.DIN_FROM 6 CONFIG.DIN_TO 6 CONFIG.DIN_WIDTH 8 CONFIG.DOUT_WIDTH 1} [get_bd_cells mb3_timer_capture_6]
create_bd_cell -type ip -vlnv xilinx.com:ip:xlslice:1.0 mb3_timer_capture_7
set_property -dict {CONFIG.DIN_FROM 7 CONFIG.DIN_TO 7 CONFIG.DIN_WIDTH 8 CONFIG.DOUT_WIDTH 1} [get_bd_cells mb3_timer_capture_7]
create_bd_cell -type ip -vlnv xilinx.com:ip:xlconcat:2.1 mb3_timer_generate
set_property -dict {CONFIG.NUM_PORTS 8} [get_bd_cells mb3_timer_generate]
create_bd_cell -type ip -vlnv xilinx.com:ip:xlconcat:2.1 mb3_timer_pwm
set_property -dict {CONFIG.NUM_PORTS 6} [get_bd_cells mb3_timer_pwm]
create_bd_cell -type ip -vlnv xilinx.com:ip:xlconcat:2.1 mb3_timers_interrupt
set_property -dict {CONFIG.NUM_PORTS 6} [get_bd_cells mb3_timers_interrupt]
create_bd_cell -type ip -vlnv xilinx.com:ip:axi_timer:2.0 timer_0
create_bd_cell -type ip -vlnv xilinx.com:ip:axi_timer:2.0 timer_1
create_bd_cell -type ip -vlnv xilinx.com:ip:axi_timer:2.0 timer_2
create_bd_cell -type ip -vlnv xilinx.com:ip:axi_timer:2.0 timer_3
create_bd_cell -type ip -vlnv xilinx.com:ip:axi_timer:2.0 timer_4
create_bd_cell -type ip -vlnv xilinx.com:ip:axi_timer:2.0 timer_5

# ---- hierarchy /iop_pmoda ----
current_bd_instance /iop_pmoda
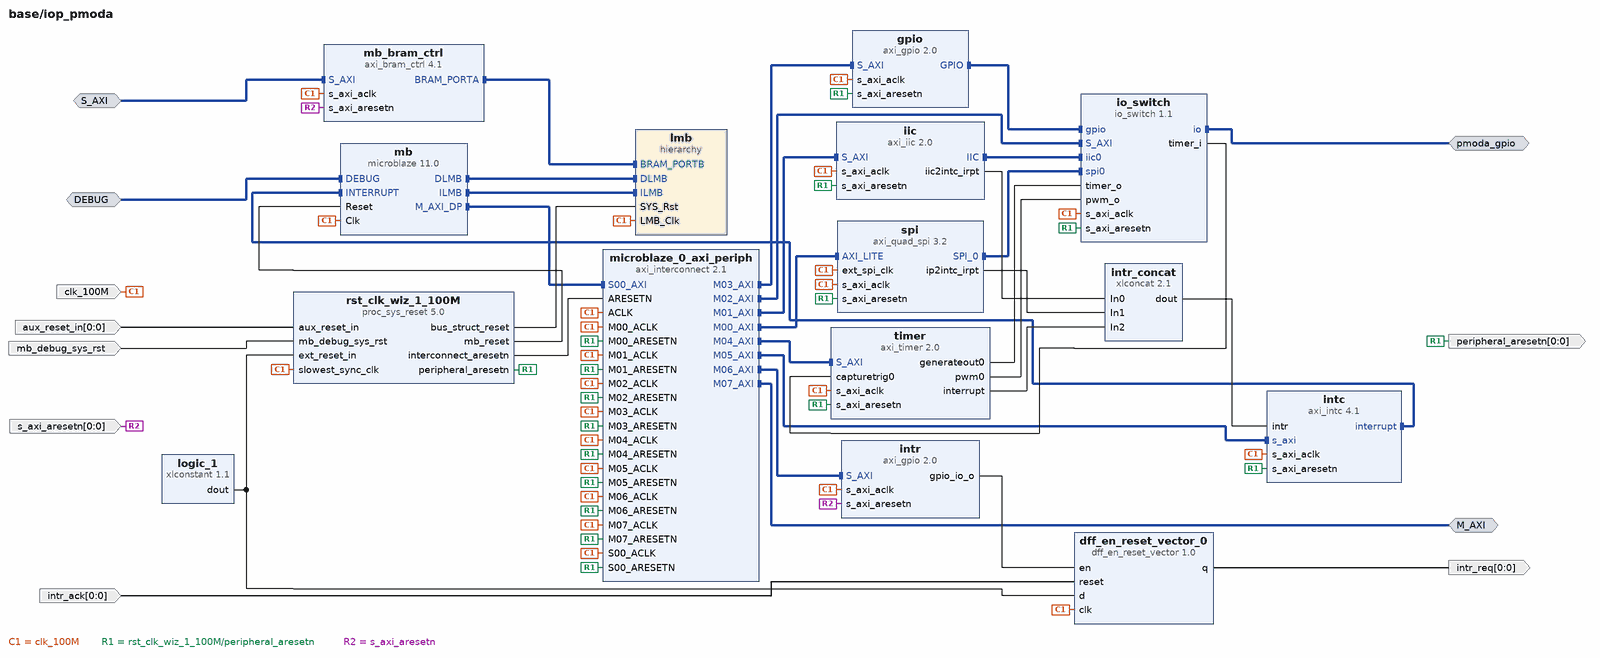
[diagram p7: block diagram inside /iop_pmoda]
create_bd_intf_pin -mode Slave -vlnv xilinx.com:interface:mbdebug_rtl:3.0 DEBUG
create_bd_intf_pin -mode Master -vlnv xilinx.com:interface:aximm_rtl:1.0 M_AXI
create_bd_intf_pin -mode Slave -vlnv xilinx.com:interface:aximm_rtl:1.0 S_AXI
create_bd_intf_pin -mode Master -vlnv xilinx.com:interface:gpio_rtl:1.0 pmoda_gpio
create_bd_pin -dir I -from 0 -to 0 -type rst aux_reset_in
create_bd_pin -dir I -type clk clk_100M
create_bd_pin -dir I -from 0 -to 0 intr_ack
create_bd_pin -dir O -from 0 -to 0 intr_req
create_bd_pin -dir I -type rst mb_debug_sys_rst
create_bd_pin -dir O -from 0 -to 0 -type rst peripheral_aresetn
create_bd_pin -dir I -from 0 -to 0 -type rst s_axi_aresetn

create_bd_cell -type ip -vlnv xilinx.com:user:dff_en_reset_vector:1.0 dff_en_reset_vector_0
set_property -dict {CONFIG.SIZE 1} [get_bd_cells dff_en_reset_vector_0]
create_bd_cell -type ip -vlnv xilinx.com:ip:axi_gpio:2.0 gpio
set_property -dict {CONFIG.C_GPIO_WIDTH 8 CONFIG.C_IS_DUAL 0} [get_bd_cells gpio]
create_bd_cell -type ip -vlnv xilinx.com:ip:axi_iic:2.0 iic
create_bd_cell -type ip -vlnv xilinx.com:ip:axi_intc:4.1 intc
create_bd_cell -type ip -vlnv xilinx.com:ip:axi_gpio:2.0 intr
set_property -dict {CONFIG.C_ALL_OUTPUTS 1 CONFIG.C_GPIO_WIDTH 1} [get_bd_cells intr]
create_bd_cell -type ip -vlnv xilinx.com:ip:xlconcat:2.1 intr_concat
set_property -dict {CONFIG.NUM_PORTS 3} [get_bd_cells intr_concat]
create_bd_cell -type ip -vlnv xilinx.com:user:io_switch:1.1 io_switch
set_property -dict [list \
  CONFIG.C_INTERFACE_TYPE 1 \
  CONFIG.C_IO_SWITCH_WIDTH 8 \
  CONFIG.C_NUM_PWMS 1 \
  CONFIG.C_NUM_TIMERS 1 \
  CONFIG.I2C0_Enable true \
  CONFIG.PWM_Enable true \
  CONFIG.SPI0_Enable true \
  CONFIG.Timer_Enable true \
] [get_bd_cells io_switch]
create_bd_cell -type hier lmb
create_bd_cell -type ip -vlnv xilinx.com:ip:xlconstant:1.1 logic_1
create_bd_cell -type ip -vlnv xilinx.com:ip:microblaze:11.0 mb
set_property -dict {CONFIG.C_DEBUG_ENABLED 1 CONFIG.C_D_AXI 1 CONFIG.C_D_LMB 1 CONFIG.C_I_LMB 1} [get_bd_cells mb]
create_bd_cell -type ip -vlnv xilinx.com:ip:axi_bram_ctrl:4.1 mb_bram_ctrl
set_property -dict {CONFIG.SINGLE_PORT_BRAM 1} [get_bd_cells mb_bram_ctrl]
create_bd_cell -type ip -vlnv xilinx.com:ip:axi_interconnect:2.1 microblaze_0_axi_periph
set_property -dict [list \
  CONFIG.M00_HAS_REGSLICE 1 \
  CONFIG.M01_HAS_REGSLICE 1 \
  CONFIG.M02_HAS_REGSLICE 1 \
  CONFIG.M03_HAS_REGSLICE 1 \
  CONFIG.M04_HAS_REGSLICE 1 \
  CONFIG.M05_HAS_REGSLICE 1 \
  CONFIG.M06_HAS_REGSLICE 1 \
  CONFIG.M07_HAS_REGSLICE 1 \
  CONFIG.NUM_MI 8 \
  CONFIG.S00_HAS_REGSLICE 1 \
] [get_bd_cells microblaze_0_axi_periph]
create_bd_cell -type ip -vlnv xilinx.com:ip:proc_sys_reset:5.0 rst_clk_wiz_1_100M
set_property -dict {CONFIG.C_AUX_RESET_HIGH 1} [get_bd_cells rst_clk_wiz_1_100M]
create_bd_cell -type ip -vlnv xilinx.com:ip:axi_quad_spi:3.2 spi
set_property -dict {CONFIG.C_USE_STARTUP 0} [get_bd_cells spi]
create_bd_cell -type ip -vlnv xilinx.com:ip:axi_timer:2.0 timer

# ---- hierarchy /iop_pmoda/lmb ----
current_bd_instance /iop_pmoda/lmb
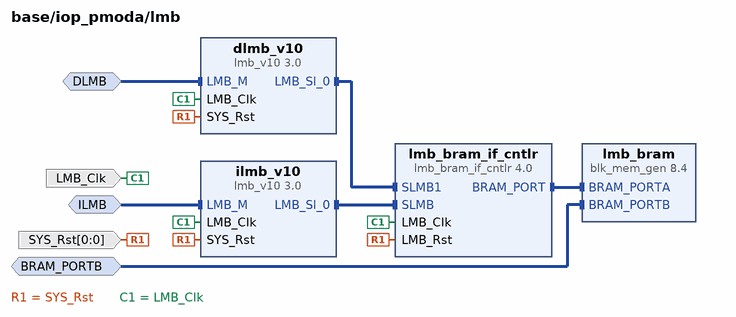
[diagram p8: block diagram inside /iop_pmoda/lmb]
create_bd_intf_pin -mode Slave -vlnv xilinx.com:interface:bram_rtl:1.0 BRAM_PORTB
create_bd_intf_pin -mode MirroredMaster -vlnv xilinx.com:interface:lmb_rtl:1.0 DLMB
create_bd_intf_pin -mode MirroredMaster -vlnv xilinx.com:interface:lmb_rtl:1.0 ILMB
create_bd_pin -dir I -type clk LMB_Clk
create_bd_pin -dir I -from 0 -to 0 -type rst SYS_Rst

create_bd_cell -type ip -vlnv xilinx.com:ip:lmb_v10:3.0 dlmb_v10
create_bd_cell -type ip -vlnv xilinx.com:ip:lmb_v10:3.0 ilmb_v10
create_bd_cell -type ip -vlnv xilinx.com:ip:blk_mem_gen:8.4 lmb_bram
set_property -dict [list \
  CONFIG.Enable_B Use_ENB_Pin \
  CONFIG.Memory_Type True_Dual_Port_RAM \
  CONFIG.Port_B_Clock 100 \
  CONFIG.Port_B_Enable_Rate 100 \
  CONFIG.Port_B_Write_Rate 50 \
  CONFIG.Use_RSTB_Pin true \
  CONFIG.use_bram_block BRAM_Controller \
] [get_bd_cells lmb_bram]
create_bd_cell -type ip -vlnv xilinx.com:ip:lmb_bram_if_cntlr:4.0 lmb_bram_if_cntlr
set_property -dict {CONFIG.C_ECC 0 CONFIG.C_NUM_LMB 2} [get_bd_cells lmb_bram_if_cntlr]

# ---- hierarchy /iop_pmodb ----
current_bd_instance /iop_pmodb
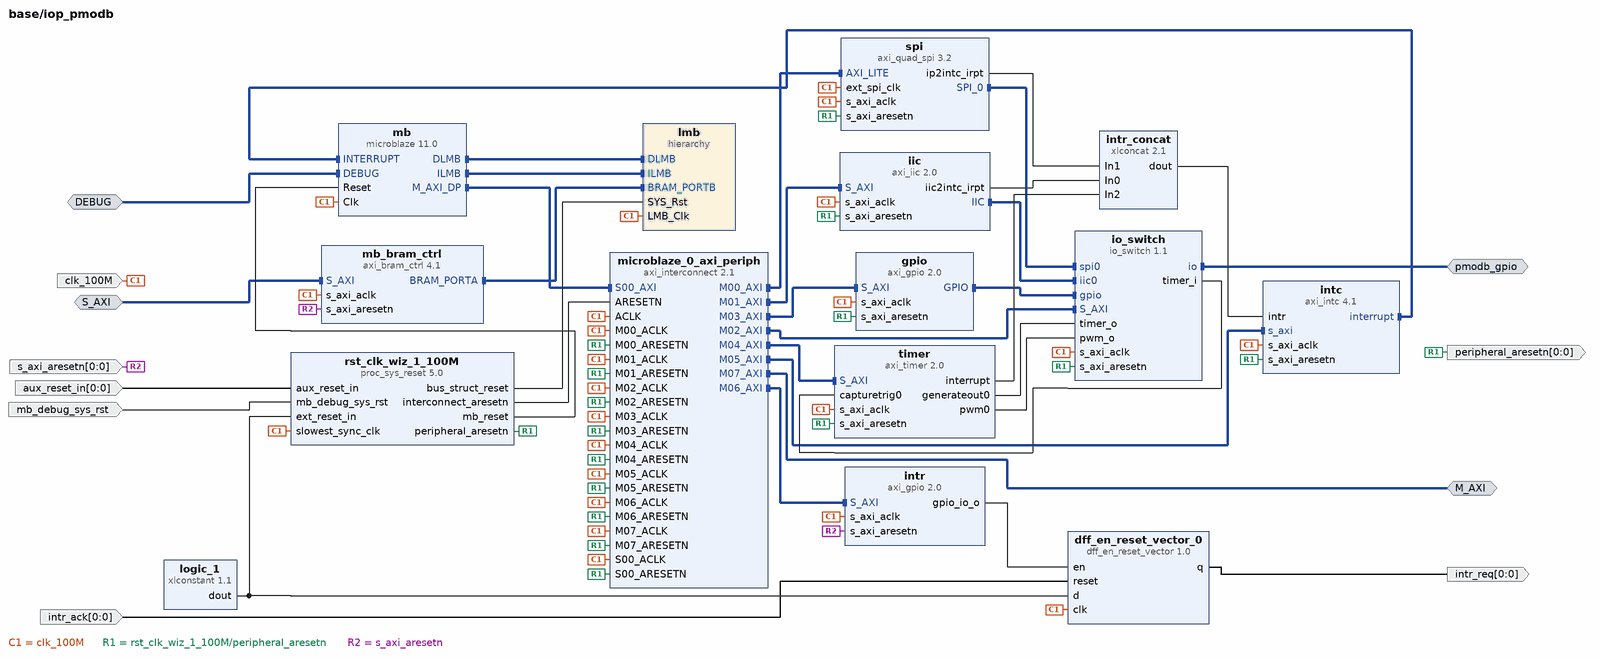
[diagram p9: block diagram inside /iop_pmodb]
create_bd_intf_pin -mode Slave -vlnv xilinx.com:interface:mbdebug_rtl:3.0 DEBUG
create_bd_intf_pin -mode Master -vlnv xilinx.com:interface:aximm_rtl:1.0 M_AXI
create_bd_intf_pin -mode Slave -vlnv xilinx.com:interface:aximm_rtl:1.0 S_AXI
create_bd_intf_pin -mode Master -vlnv xilinx.com:interface:gpio_rtl:1.0 pmodb_gpio
create_bd_pin -dir I -from 0 -to 0 -type rst aux_reset_in
create_bd_pin -dir I -type clk clk_100M
create_bd_pin -dir I -from 0 -to 0 intr_ack
create_bd_pin -dir O -from 0 -to 0 intr_req
create_bd_pin -dir I -type rst mb_debug_sys_rst
create_bd_pin -dir O -from 0 -to 0 -type rst peripheral_aresetn
create_bd_pin -dir I -from 0 -to 0 -type rst s_axi_aresetn

create_bd_cell -type ip -vlnv xilinx.com:user:dff_en_reset_vector:1.0 dff_en_reset_vector_0
set_property -dict {CONFIG.SIZE 1} [get_bd_cells dff_en_reset_vector_0]
create_bd_cell -type ip -vlnv xilinx.com:ip:axi_gpio:2.0 gpio
set_property -dict {CONFIG.C_GPIO_WIDTH 8 CONFIG.C_IS_DUAL 0} [get_bd_cells gpio]
create_bd_cell -type ip -vlnv xilinx.com:ip:axi_iic:2.0 iic
create_bd_cell -type ip -vlnv xilinx.com:ip:axi_intc:4.1 intc
create_bd_cell -type ip -vlnv xilinx.com:ip:axi_gpio:2.0 intr
set_property -dict {CONFIG.C_ALL_OUTPUTS 1 CONFIG.C_GPIO_WIDTH 1} [get_bd_cells intr]
create_bd_cell -type ip -vlnv xilinx.com:ip:xlconcat:2.1 intr_concat
set_property -dict {CONFIG.NUM_PORTS 3} [get_bd_cells intr_concat]
create_bd_cell -type ip -vlnv xilinx.com:user:io_switch:1.1 io_switch
set_property -dict [list \
  CONFIG.C_INTERFACE_TYPE 1 \
  CONFIG.C_IO_SWITCH_WIDTH 8 \
  CONFIG.C_NUM_PWMS 1 \
  CONFIG.C_NUM_TIMERS 1 \
  CONFIG.I2C0_Enable true \
  CONFIG.PWM_Enable true \
  CONFIG.SPI0_Enable true \
  CONFIG.Timer_Enable true \
] [get_bd_cells io_switch]
create_bd_cell -type hier lmb
create_bd_cell -type ip -vlnv xilinx.com:ip:xlconstant:1.1 logic_1
create_bd_cell -type ip -vlnv xilinx.com:ip:microblaze:11.0 mb
set_property -dict {CONFIG.C_DEBUG_ENABLED 1 CONFIG.C_D_AXI 1 CONFIG.C_D_LMB 1 CONFIG.C_I_LMB 1} [get_bd_cells mb]
create_bd_cell -type ip -vlnv xilinx.com:ip:axi_bram_ctrl:4.1 mb_bram_ctrl
set_property -dict {CONFIG.SINGLE_PORT_BRAM 1} [get_bd_cells mb_bram_ctrl]
create_bd_cell -type ip -vlnv xilinx.com:ip:axi_interconnect:2.1 microblaze_0_axi_periph
set_property -dict [list \
  CONFIG.M00_HAS_REGSLICE 1 \
  CONFIG.M01_HAS_REGSLICE 1 \
  CONFIG.M02_HAS_REGSLICE 1 \
  CONFIG.M03_HAS_REGSLICE 1 \
  CONFIG.M04_HAS_REGSLICE 1 \
  CONFIG.M05_HAS_REGSLICE 1 \
  CONFIG.M06_HAS_REGSLICE 1 \
  CONFIG.M07_HAS_REGSLICE 1 \
  CONFIG.NUM_MI 8 \
  CONFIG.S00_HAS_REGSLICE 1 \
] [get_bd_cells microblaze_0_axi_periph]
create_bd_cell -type ip -vlnv xilinx.com:ip:proc_sys_reset:5.0 rst_clk_wiz_1_100M
set_property -dict {CONFIG.C_AUX_RESET_HIGH 1} [get_bd_cells rst_clk_wiz_1_100M]
create_bd_cell -type ip -vlnv xilinx.com:ip:axi_quad_spi:3.2 spi
set_property -dict {CONFIG.C_USE_STARTUP 0} [get_bd_cells spi]
create_bd_cell -type ip -vlnv xilinx.com:ip:axi_timer:2.0 timer

# ---- hierarchy /iop_pmodb/lmb ----
current_bd_instance /iop_pmodb/lmb
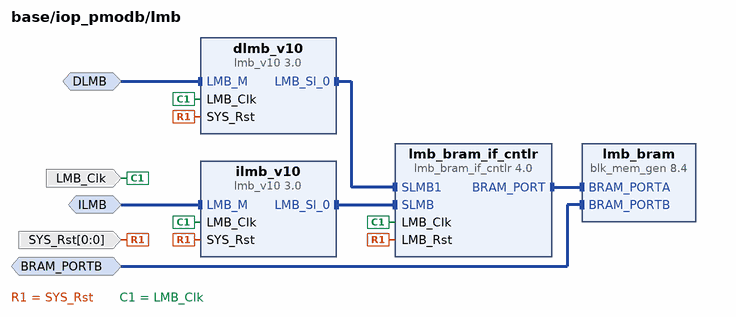
[diagram p10: block diagram inside /iop_pmodb/lmb]
create_bd_intf_pin -mode Slave -vlnv xilinx.com:interface:bram_rtl:1.0 BRAM_PORTB
create_bd_intf_pin -mode MirroredMaster -vlnv xilinx.com:interface:lmb_rtl:1.0 DLMB
create_bd_intf_pin -mode MirroredMaster -vlnv xilinx.com:interface:lmb_rtl:1.0 ILMB
create_bd_pin -dir I -type clk LMB_Clk
create_bd_pin -dir I -from 0 -to 0 -type rst SYS_Rst

create_bd_cell -type ip -vlnv xilinx.com:ip:lmb_v10:3.0 dlmb_v10
create_bd_cell -type ip -vlnv xilinx.com:ip:lmb_v10:3.0 ilmb_v10
create_bd_cell -type ip -vlnv xilinx.com:ip:blk_mem_gen:8.4 lmb_bram
set_property -dict [list \
  CONFIG.Enable_B Use_ENB_Pin \
  CONFIG.Memory_Type True_Dual_Port_RAM \
  CONFIG.Port_B_Clock 100 \
  CONFIG.Port_B_Enable_Rate 100 \
  CONFIG.Port_B_Write_Rate 50 \
  CONFIG.Use_RSTB_Pin true \
  CONFIG.use_bram_block BRAM_Controller \
] [get_bd_cells lmb_bram]
create_bd_cell -type ip -vlnv xilinx.com:ip:lmb_bram_if_cntlr:4.0 lmb_bram_if_cntlr
set_property -dict {CONFIG.C_ECC 0 CONFIG.C_NUM_LMB 2} [get_bd_cells lmb_bram_if_cntlr]

# ---- hierarchy /iop_rpi ----
current_bd_instance /iop_rpi
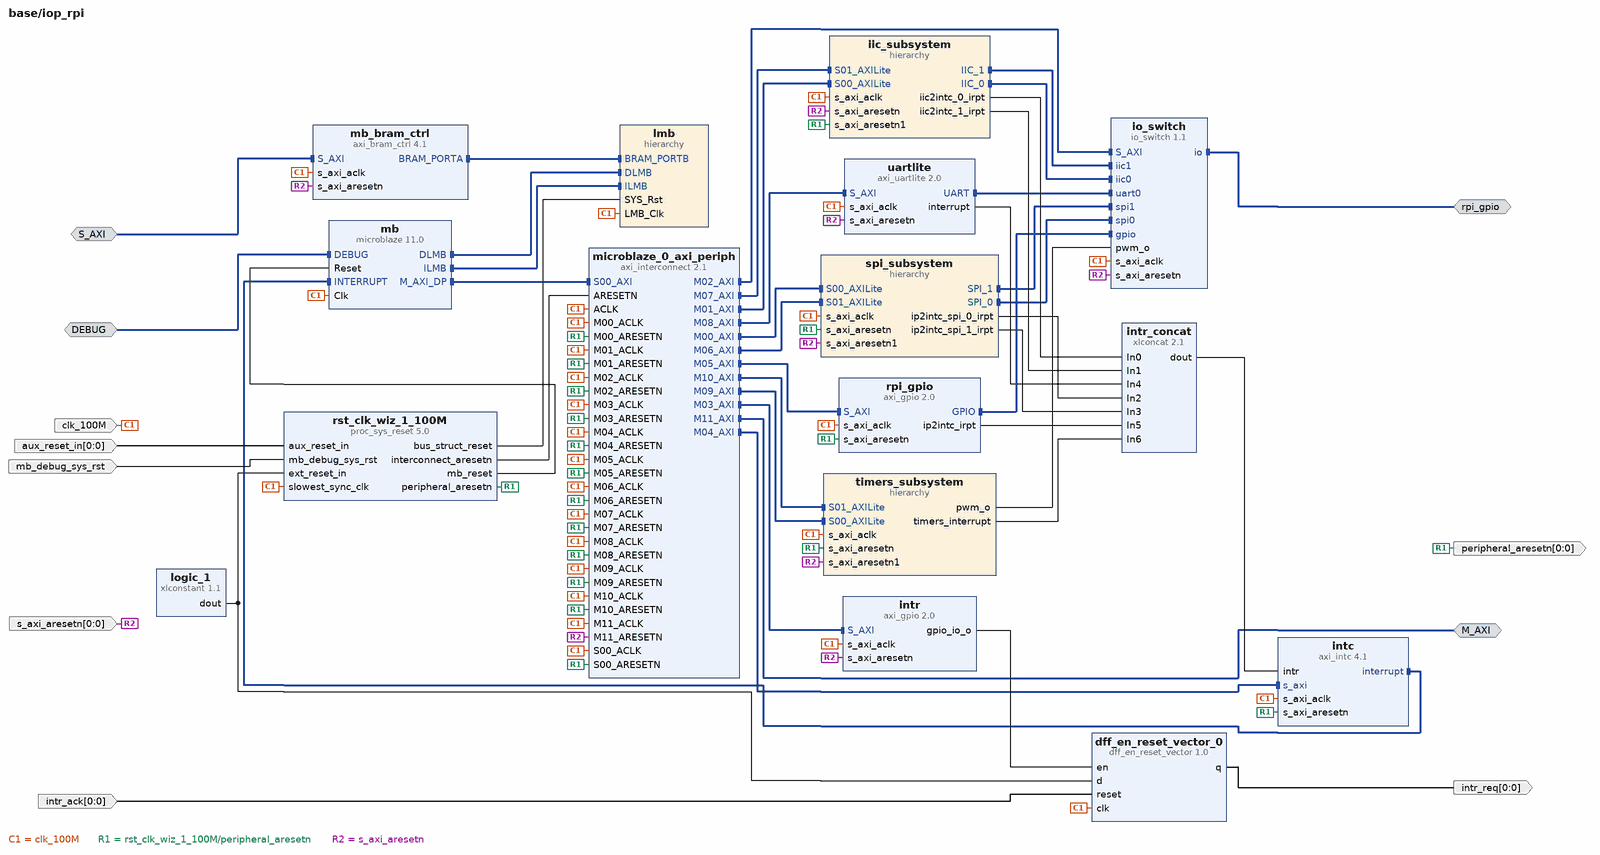
[diagram p11: block diagram inside /iop_rpi]
create_bd_intf_pin -mode Slave -vlnv xilinx.com:interface:mbdebug_rtl:3.0 DEBUG
create_bd_intf_pin -mode Master -vlnv xilinx.com:interface:aximm_rtl:1.0 M_AXI
create_bd_intf_pin -mode Slave -vlnv xilinx.com:interface:aximm_rtl:1.0 S_AXI
create_bd_intf_pin -mode Master -vlnv xilinx.com:interface:gpio_rtl:1.0 rpi_gpio
create_bd_pin -dir I -from 0 -to 0 -type rst aux_reset_in
create_bd_pin -dir I -type clk clk_100M
create_bd_pin -dir I -from 0 -to 0 intr_ack
create_bd_pin -dir O -from 0 -to 0 intr_req
create_bd_pin -dir I -type rst mb_debug_sys_rst
create_bd_pin -dir O -from 0 -to 0 -type rst peripheral_aresetn
create_bd_pin -dir I -from 0 -to 0 -type rst s_axi_aresetn

create_bd_cell -type ip -vlnv xilinx.com:user:dff_en_reset_vector:1.0 dff_en_reset_vector_0
set_property -dict {CONFIG.SIZE 1} [get_bd_cells dff_en_reset_vector_0]
create_bd_cell -type hier iic_subsystem
create_bd_cell -type ip -vlnv xilinx.com:ip:axi_intc:4.1 intc
create_bd_cell -type ip -vlnv xilinx.com:ip:axi_gpio:2.0 intr
set_property -dict {CONFIG.C_ALL_OUTPUTS 1 CONFIG.C_GPIO_WIDTH 1} [get_bd_cells intr]
create_bd_cell -type ip -vlnv xilinx.com:ip:xlconcat:2.1 intr_concat
set_property -dict {CONFIG.NUM_PORTS 7} [get_bd_cells intr_concat]
create_bd_cell -type ip -vlnv xilinx.com:user:io_switch:1.1 io_switch
set_property -dict [list \
  CONFIG.C_INTERFACE_TYPE 4 \
  CONFIG.C_IO_SWITCH_WIDTH 28 \
  CONFIG.C_NUM_PWMS 2 \
  CONFIG.C_NUM_SS 2 \
  CONFIG.I2C0_Enable true \
  CONFIG.I2C1_Enable true \
  CONFIG.PWM_Enable true \
  CONFIG.SPI0_Enable true \
  CONFIG.SPI1_Enable true \
  CONFIG.Timer_Enable false \
  CONFIG.UART0_Enable true \
] [get_bd_cells io_switch]
create_bd_cell -type hier lmb
create_bd_cell -type ip -vlnv xilinx.com:ip:xlconstant:1.1 logic_1
create_bd_cell -type ip -vlnv xilinx.com:ip:microblaze:11.0 mb
set_property -dict {CONFIG.C_DEBUG_ENABLED 1 CONFIG.C_D_AXI 1 CONFIG.C_D_LMB 1 CONFIG.C_I_LMB 1} [get_bd_cells mb]
create_bd_cell -type ip -vlnv xilinx.com:ip:axi_bram_ctrl:4.1 mb_bram_ctrl
set_property -dict {CONFIG.SINGLE_PORT_BRAM 1} [get_bd_cells mb_bram_ctrl]
create_bd_cell -type ip -vlnv xilinx.com:ip:axi_interconnect:2.1 microblaze_0_axi_periph
set_property -dict [list \
  CONFIG.M00_HAS_REGSLICE 1 \
  CONFIG.M01_HAS_REGSLICE 1 \
  CONFIG.M02_HAS_REGSLICE 1 \
  CONFIG.M03_HAS_REGSLICE 1 \
  CONFIG.M04_HAS_REGSLICE 1 \
  CONFIG.M05_HAS_REGSLICE 1 \
  CONFIG.M06_HAS_REGSLICE 1 \
  CONFIG.M07_HAS_REGSLICE 1 \
  CONFIG.M08_HAS_REGSLICE 1 \
  CONFIG.M09_HAS_REGSLICE 1 \
  CONFIG.M10_HAS_REGSLICE 1 \
  CONFIG.M11_HAS_REGSLICE 1 \
  CONFIG.M12_HAS_REGSLICE 1 \
  CONFIG.NUM_MI 12 \
  CONFIG.S00_HAS_REGSLICE 1 \
] [get_bd_cells microblaze_0_axi_periph]
create_bd_cell -type ip -vlnv xilinx.com:ip:axi_gpio:2.0 rpi_gpio
set_property -dict {CONFIG.C_GPIO_WIDTH 28 CONFIG.C_INTERRUPT_PRESENT 1 CONFIG.C_IS_DUAL 0} [get_bd_cells rpi_gpio]
create_bd_cell -type ip -vlnv xilinx.com:ip:proc_sys_reset:5.0 rst_clk_wiz_1_100M
set_property -dict {CONFIG.C_AUX_RESET_HIGH 1} [get_bd_cells rst_clk_wiz_1_100M]
create_bd_cell -type hier spi_subsystem
create_bd_cell -type hier timers_subsystem
create_bd_cell -type ip -vlnv xilinx.com:ip:axi_uartlite:2.0 uartlite
set_property -dict {CONFIG.C_BAUDRATE 9600} [get_bd_cells uartlite]

# ---- hierarchy /iop_rpi/iic_subsystem ----
current_bd_instance /iop_rpi/iic_subsystem
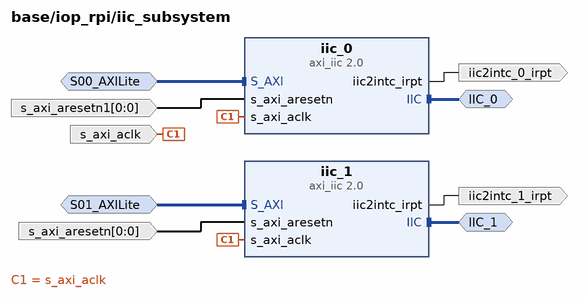
[diagram p12: block diagram inside /iop_rpi/iic_subsystem]
create_bd_intf_pin -mode Master -vlnv xilinx.com:interface:iic_rtl:1.0 IIC_0
create_bd_intf_pin -mode Master -vlnv xilinx.com:interface:iic_rtl:1.0 IIC_1
create_bd_intf_pin -mode Slave -vlnv xilinx.com:interface:aximm_rtl:1.0 S00_AXILite
create_bd_intf_pin -mode Slave -vlnv xilinx.com:interface:aximm_rtl:1.0 S01_AXILite
create_bd_pin -dir O -type intr iic2intc_0_irpt
create_bd_pin -dir O iic2intc_1_irpt
create_bd_pin -dir I -type clk s_axi_aclk
create_bd_pin -dir I -from 0 -to 0 -type rst s_axi_aresetn
create_bd_pin -dir I -from 0 -to 0 -type rst s_axi_aresetn1

create_bd_cell -type ip -vlnv xilinx.com:ip:axi_iic:2.0 iic_0
create_bd_cell -type ip -vlnv xilinx.com:ip:axi_iic:2.0 iic_1

# ---- hierarchy /iop_rpi/lmb ----
current_bd_instance /iop_rpi/lmb
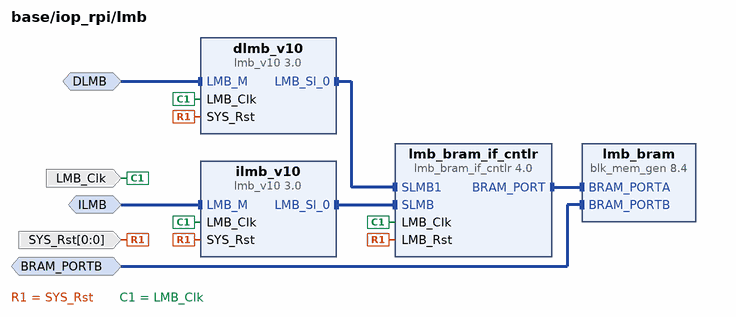
[diagram p13: block diagram inside /iop_rpi/lmb]
create_bd_intf_pin -mode Slave -vlnv xilinx.com:interface:bram_rtl:1.0 BRAM_PORTB
create_bd_intf_pin -mode MirroredMaster -vlnv xilinx.com:interface:lmb_rtl:1.0 DLMB
create_bd_intf_pin -mode MirroredMaster -vlnv xilinx.com:interface:lmb_rtl:1.0 ILMB
create_bd_pin -dir I -type clk LMB_Clk
create_bd_pin -dir I -from 0 -to 0 -type rst SYS_Rst

create_bd_cell -type ip -vlnv xilinx.com:ip:lmb_v10:3.0 dlmb_v10
create_bd_cell -type ip -vlnv xilinx.com:ip:lmb_v10:3.0 ilmb_v10
create_bd_cell -type ip -vlnv xilinx.com:ip:blk_mem_gen:8.4 lmb_bram
set_property -dict [list \
  CONFIG.Enable_B Use_ENB_Pin \
  CONFIG.Memory_Type True_Dual_Port_RAM \
  CONFIG.Port_B_Clock 100 \
  CONFIG.Port_B_Enable_Rate 100 \
  CONFIG.Port_B_Write_Rate 50 \
  CONFIG.Use_RSTB_Pin true \
  CONFIG.use_bram_block BRAM_Controller \
] [get_bd_cells lmb_bram]
create_bd_cell -type ip -vlnv xilinx.com:ip:lmb_bram_if_cntlr:4.0 lmb_bram_if_cntlr
set_property -dict {CONFIG.C_ECC 0 CONFIG.C_NUM_LMB 2} [get_bd_cells lmb_bram_if_cntlr]

# ---- hierarchy /iop_rpi/spi_subsystem ----
current_bd_instance /iop_rpi/spi_subsystem
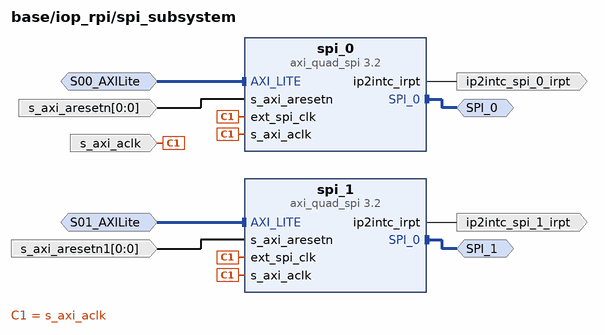
[diagram p14: block diagram inside /iop_rpi/spi_subsystem]
create_bd_intf_pin -mode Slave -vlnv xilinx.com:interface:aximm_rtl:1.0 S00_AXILite
create_bd_intf_pin -mode Slave -vlnv xilinx.com:interface:aximm_rtl:1.0 S01_AXILite
create_bd_intf_pin -mode Master -vlnv xilinx.com:interface:spi_rtl:1.0 SPI_0
create_bd_intf_pin -mode Master -vlnv xilinx.com:interface:spi_rtl:1.0 SPI_1
create_bd_pin -dir O -type intr ip2intc_spi_0_irpt
create_bd_pin -dir O ip2intc_spi_1_irpt
create_bd_pin -dir I -type clk s_axi_aclk
create_bd_pin -dir I -from 0 -to 0 -type rst s_axi_aresetn
create_bd_pin -dir I -from 0 -to 0 -type rst s_axi_aresetn1

create_bd_cell -type ip -vlnv xilinx.com:ip:axi_quad_spi:3.2 spi_0
set_property -dict {CONFIG.C_NUM_SS_BITS 2 CONFIG.C_USE_STARTUP 0} [get_bd_cells spi_0]
create_bd_cell -type ip -vlnv xilinx.com:ip:axi_quad_spi:3.2 spi_1
set_property -dict {CONFIG.C_USE_STARTUP 0} [get_bd_cells spi_1]

# ---- hierarchy /iop_rpi/timers_subsystem ----
current_bd_instance /iop_rpi/timers_subsystem
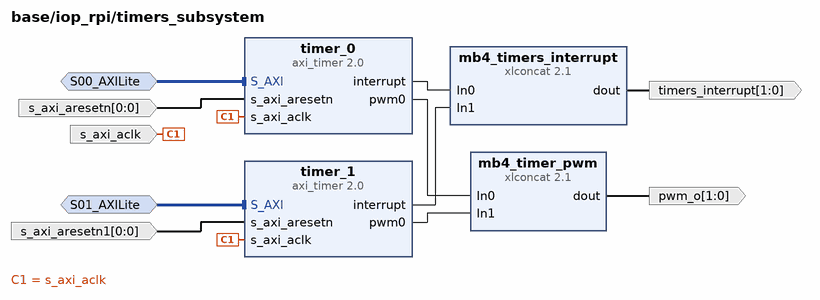
[diagram p15: block diagram inside /iop_rpi/timers_subsystem]
create_bd_intf_pin -mode Slave -vlnv xilinx.com:interface:aximm_rtl:1.0 S00_AXILite
create_bd_intf_pin -mode Slave -vlnv xilinx.com:interface:aximm_rtl:1.0 S01_AXILite
create_bd_pin -dir O -from 1 -to 0 pwm_o
create_bd_pin -dir I -type clk s_axi_aclk
create_bd_pin -dir I -from 0 -to 0 -type rst s_axi_aresetn
create_bd_pin -dir I -from 0 -to 0 -type rst s_axi_aresetn1
create_bd_pin -dir O -from 1 -to 0 timers_interrupt

create_bd_cell -type ip -vlnv xilinx.com:ip:xlconcat:2.1 mb4_timer_pwm
set_property -dict {CONFIG.NUM_PORTS 2} [get_bd_cells mb4_timer_pwm]
create_bd_cell -type ip -vlnv xilinx.com:ip:xlconcat:2.1 mb4_timers_interrupt
set_property -dict {CONFIG.NUM_PORTS 2} [get_bd_cells mb4_timers_interrupt]
create_bd_cell -type ip -vlnv xilinx.com:ip:axi_timer:2.0 timer_0
create_bd_cell -type ip -vlnv xilinx.com:ip:axi_timer:2.0 timer_1

# ---- hierarchy /trace_analyzer_pi ----
current_bd_instance /trace_analyzer_pi
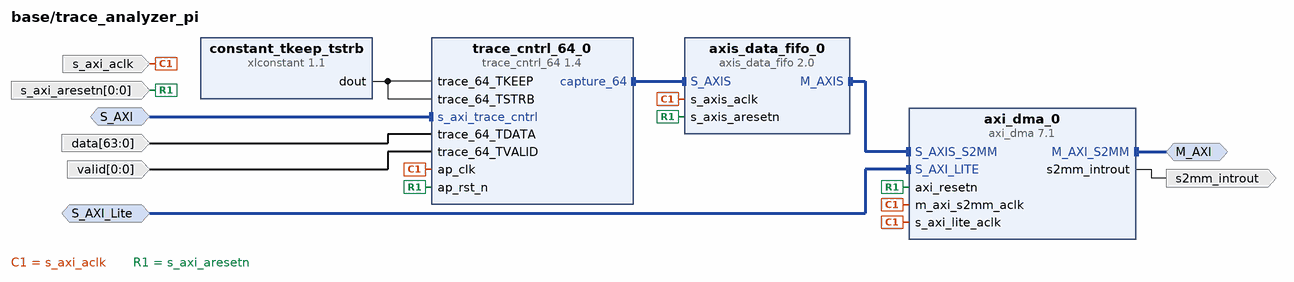
[diagram p16: block diagram inside /trace_analyzer_pi]
create_bd_intf_pin -mode Master -vlnv xilinx.com:interface:aximm_rtl:1.0 M_AXI
create_bd_intf_pin -mode Slave -vlnv xilinx.com:interface:aximm_rtl:1.0 S_AXI
create_bd_intf_pin -mode Slave -vlnv xilinx.com:interface:aximm_rtl:1.0 S_AXI_Lite
create_bd_pin -dir I -from 63 -to 0 data
create_bd_pin -dir O -type intr s2mm_introut
create_bd_pin -dir I -type clk s_axi_aclk
create_bd_pin -dir I -from 0 -to 0 -type rst s_axi_aresetn
create_bd_pin -dir I -from 0 -to 0 valid

create_bd_cell -type ip -vlnv xilinx.com:ip:axi_dma:7.1 axi_dma_0
set_property -dict [list \
  CONFIG.c_include_mm2s 0 \
  CONFIG.c_include_sg 0 \
  CONFIG.c_s2mm_burst_size 64 \
  CONFIG.c_sg_length_width 23 \
] [get_bd_cells axi_dma_0]
create_bd_cell -type ip -vlnv xilinx.com:ip:axis_data_fifo:2.0 axis_data_fifo_0
set_property -dict [list \
  CONFIG.FIFO_DEPTH 256 \
  CONFIG.HAS_RD_DATA_COUNT 1 \
  CONFIG.HAS_TLAST 1 \
  CONFIG.HAS_WR_DATA_COUNT 1 \
] [get_bd_cells axis_data_fifo_0]
create_bd_cell -type ip -vlnv xilinx.com:ip:xlconstant:1.1 constant_tkeep_tstrb
set_property -dict {CONFIG.CONST_VAL 255 CONFIG.CONST_WIDTH 8} [get_bd_cells constant_tkeep_tstrb]
create_bd_cell -type ip -vlnv xilinx.com:hls:trace_cntrl_64:1.4 trace_cntrl_64_0

# ---- hierarchy /trace_analyzer_pmodb ----
current_bd_instance /trace_analyzer_pmodb
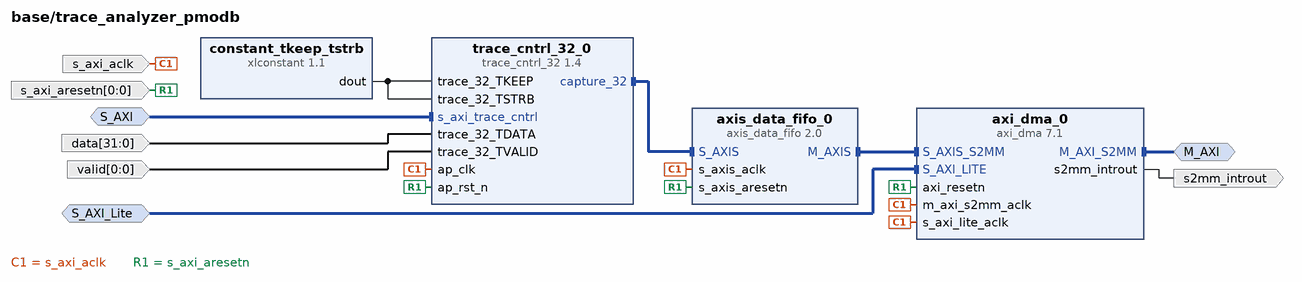
[diagram p17: block diagram inside /trace_analyzer_pmodb]
create_bd_intf_pin -mode Master -vlnv xilinx.com:interface:aximm_rtl:1.0 M_AXI
create_bd_intf_pin -mode Slave -vlnv xilinx.com:interface:aximm_rtl:1.0 S_AXI
create_bd_intf_pin -mode Slave -vlnv xilinx.com:interface:aximm_rtl:1.0 S_AXI_Lite
create_bd_pin -dir I -from 31 -to 0 data
create_bd_pin -dir O -type intr s2mm_introut
create_bd_pin -dir I -type clk s_axi_aclk
create_bd_pin -dir I -from 0 -to 0 -type rst s_axi_aresetn
create_bd_pin -dir I -from 0 -to 0 valid

create_bd_cell -type ip -vlnv xilinx.com:ip:axi_dma:7.1 axi_dma_0
set_property -dict [list \
  CONFIG.c_include_mm2s 0 \
  CONFIG.c_include_sg 0 \
  CONFIG.c_s2mm_burst_size 64 \
  CONFIG.c_sg_length_width 23 \
] [get_bd_cells axi_dma_0]
create_bd_cell -type ip -vlnv xilinx.com:ip:axis_data_fifo:2.0 axis_data_fifo_0
set_property -dict [list \
  CONFIG.FIFO_DEPTH 256 \
  CONFIG.HAS_RD_DATA_COUNT 1 \
  CONFIG.HAS_TLAST 1 \
  CONFIG.HAS_WR_DATA_COUNT 1 \
] [get_bd_cells axis_data_fifo_0]
create_bd_cell -type ip -vlnv xilinx.com:ip:xlconstant:1.1 constant_tkeep_tstrb
set_property -dict {CONFIG.CONST_VAL 15 CONFIG.CONST_WIDTH 4} [get_bd_cells constant_tkeep_tstrb]
create_bd_cell -type ip -vlnv xilinx.com:hls:trace_cntrl_32:1.4 trace_cntrl_32_0

# ---- hierarchy /video ----
current_bd_instance /video
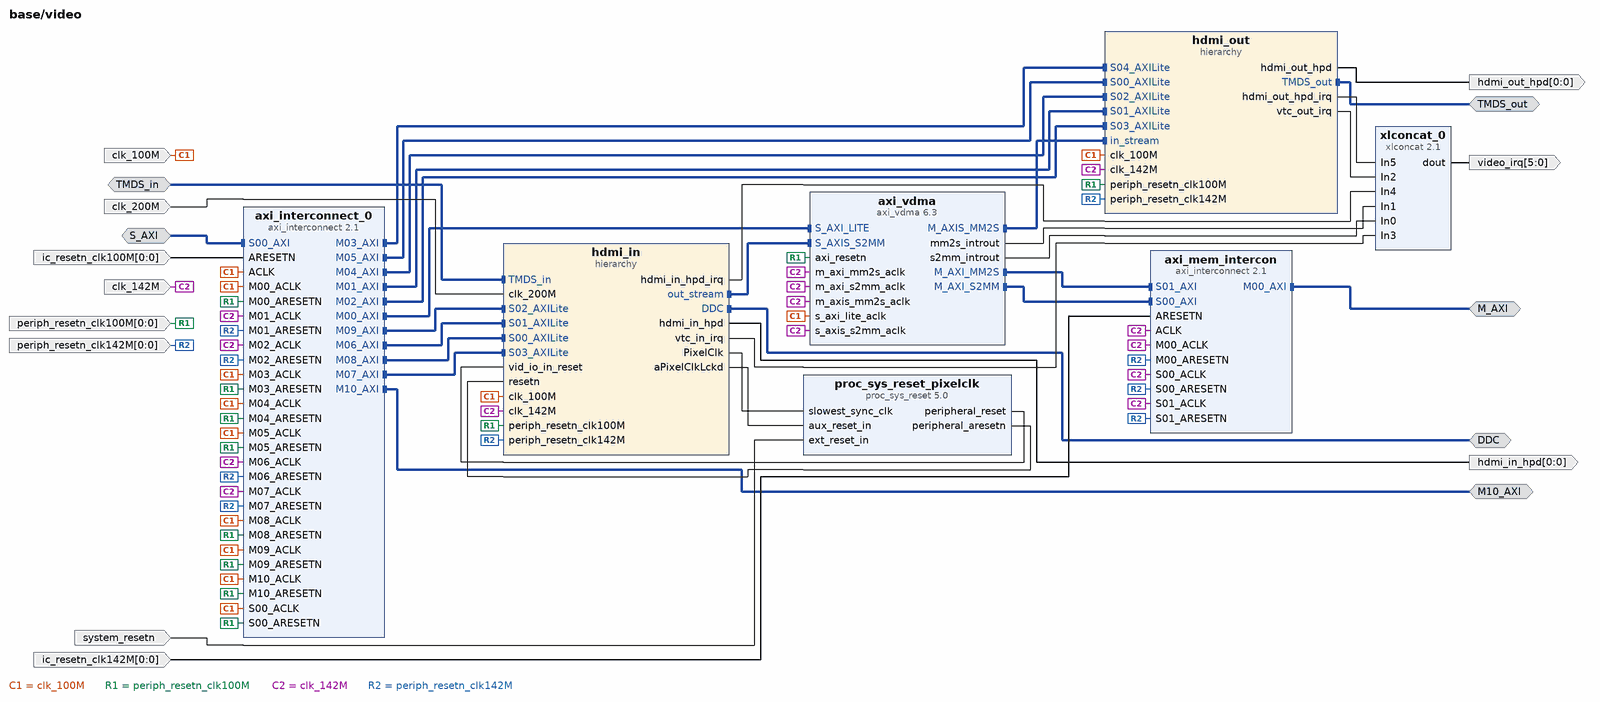
[diagram p18: block diagram inside /video]
create_bd_intf_pin -mode Master -vlnv xilinx.com:interface:iic_rtl:1.0 DDC
create_bd_intf_pin -mode Master -vlnv xilinx.com:interface:aximm_rtl:1.0 M_AXI
create_bd_intf_pin -mode Slave -vlnv xilinx.com:interface:aximm_rtl:1.0 S_AXI
create_bd_intf_pin -mode Slave -vlnv digilentinc.com:interface:tmds_rtl:1.0 TMDS_in
create_bd_intf_pin -mode Master -vlnv digilentinc.com:interface:tmds_rtl:1.0 TMDS_out
create_bd_intf_pin -mode Master -vlnv xilinx.com:interface:aximm_rtl:1.0 M10_AXI
create_bd_pin -dir I -type clk clk_100M
create_bd_pin -dir I clk_142M
create_bd_pin -dir I -type clk clk_200M
create_bd_pin -dir O -from 0 -to 0 hdmi_in_hpd
create_bd_pin -dir O -from 0 -to 0 hdmi_out_hpd
create_bd_pin -dir I -from 0 -to 0 -type rst ic_resetn_clk100M
create_bd_pin -dir I -from 0 -to 0 -type rst ic_resetn_clk142M
create_bd_pin -dir I -from 0 -to 0 -type rst periph_resetn_clk100M
create_bd_pin -dir I -from 0 -to 0 -type rst periph_resetn_clk142M
create_bd_pin -dir I -type rst system_resetn
create_bd_pin -dir O -from 5 -to 0 video_irq
